# Altium project PCB_Project.PrjPcb (part 1 of 2)
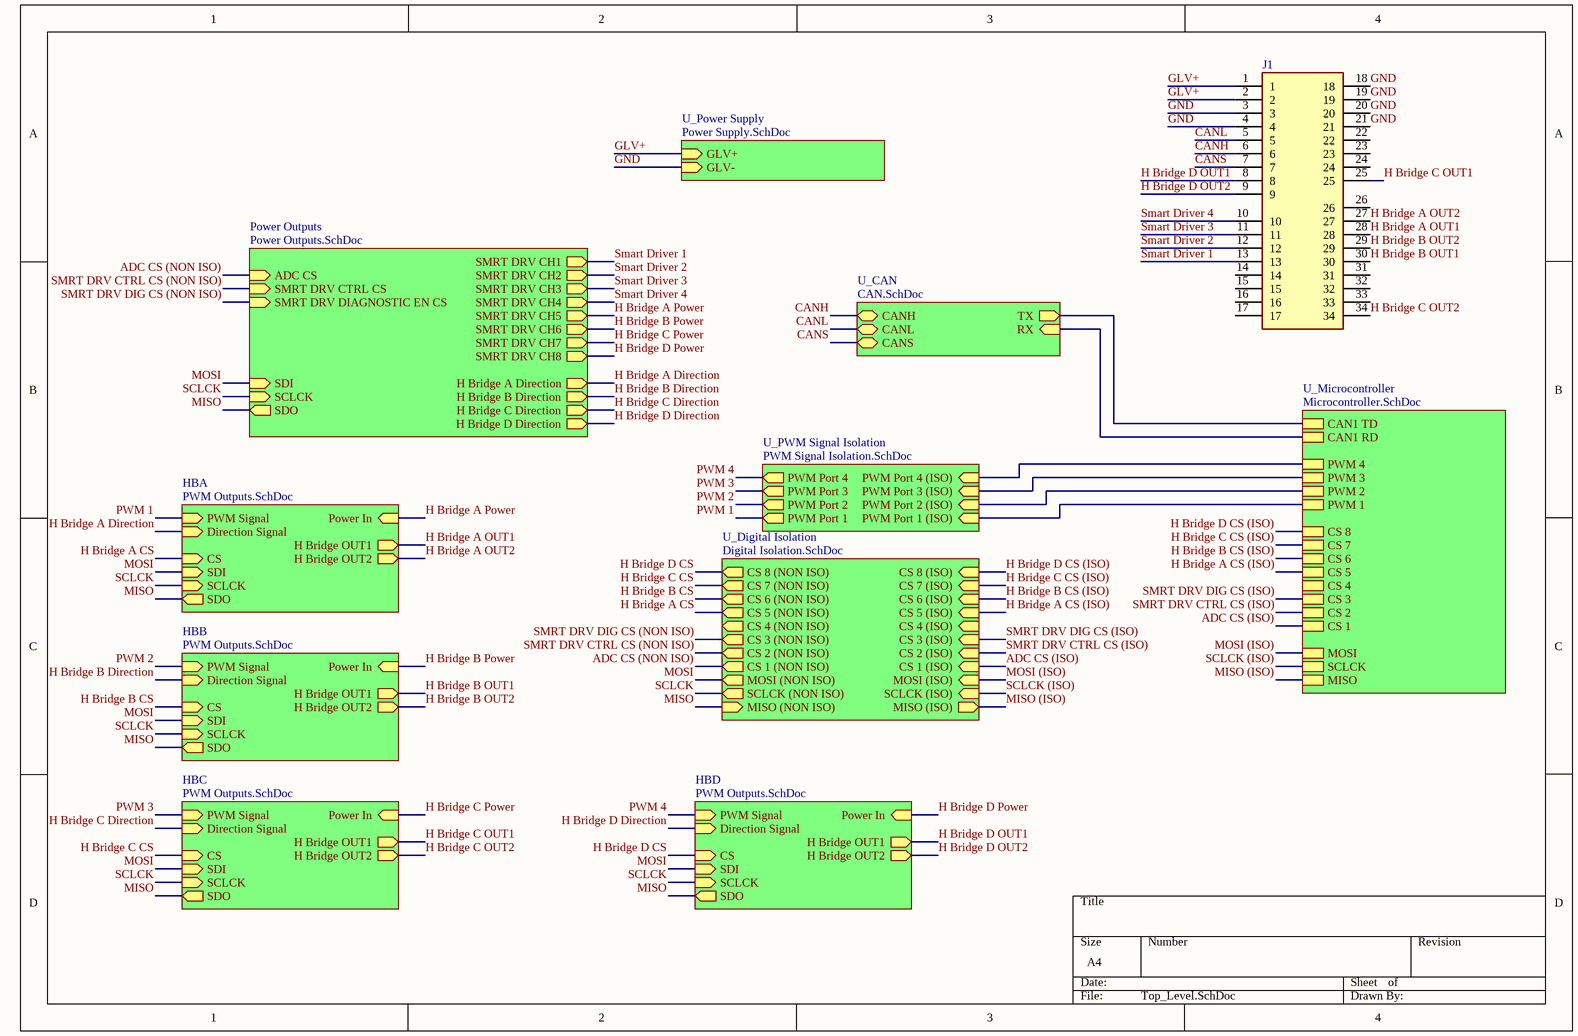
[diagram p0: Top_Level.SchDoc]
9 sheets, 193 parts. Net scope: hierarchical (ports join the sheet entries above them; power ports are global).
Board file: PCB.PcbDoc
Sheets:
  Top_Level.SchDoc
    U_Power Supply = Power Supply.SchDoc
    U_CAN = CAN.SchDoc
    Power Outputs = Power Outputs.SchDoc
      SD1 = Smart Driver Circuit.SchDoc
      SD2 = Smart Driver Circuit.SchDoc
      SD3 = Smart Driver Circuit.SchDoc
      SD4 = Smart Driver Circuit.SchDoc
    U_PWM Signal Isolation = PWM Signal Isolation.SchDoc
    U_Digital Isolation = Digital Isolation.SchDoc
    HBA = PWM Outputs.SchDoc
    HBB = PWM Outputs.SchDoc
    HBC = PWM Outputs.SchDoc
    HBD = PWM Outputs.SchDoc
    U_Microcontroller = Microcontroller.SchDoc

## Sheet Top_Level.SchDoc
size A4; SheetNumber: 1; SheetTotal: 9

### Parts
J1  (no value)  [6437288-1]

### Sub-sheets
HBA = PWM Outputs.SchDoc: PWM Signal (in), Direction Signal (in), H Bridge OUT1 (out), H Bridge OUT2 (out), SDO (out), SCLCK (in), SDI (in), CS (in), Power In (in)
HBB = PWM Outputs.SchDoc: PWM Signal (in), Direction Signal (in), H Bridge OUT1 (out), H Bridge OUT2 (out), SDO (out), SCLCK (in), SDI (in), CS (in), Power In (in)
HBC = PWM Outputs.SchDoc: PWM Signal (in), Direction Signal (in), H Bridge OUT1 (out), H Bridge OUT2 (out), SDO (out), SCLCK (in), SDI (in), CS (in), Power In (in)
HBD = PWM Outputs.SchDoc: PWM Signal (in), Direction Signal (in), H Bridge OUT1 (out), H Bridge OUT2 (out), SDO (out), SCLCK (in), SDI (in), CS (in), Power In (in)
Power Outputs = Power Outputs.SchDoc: SMRT DRV CH1 (out), SMRT DRV CH2 (out), SMRT DRV CH3 (out), SMRT DRV CH4 (out), ADC CS (in), SMRT DRV CTRL CS (in), SDO (out), SCLCK (in), SMRT DRV DIAGNOSTIC EN CS (in), SDI (in), SMRT DRV CH5 (out), SMRT DRV CH6 (out), SMRT DRV CH7 (out), SMRT DRV CH8 (out), H Bridge A Direction (out), H Bridge B Direction (out), H Bridge C Direction (out), H Bridge D Direction (out)
U_CAN = CAN.SchDoc: CANH (bidir), CANL (bidir), CANS (bidir), RX (in), TX (out)
U_Digital Isolation = Digital Isolation.SchDoc: MISO (NON ISO) (in), MOSI (NON ISO) (out), SCLCK (NON ISO) (out), MOSI (ISO) (in), SCLCK (ISO) (in), MISO (ISO) (out), CS 1 (NON ISO) (out), CS 2 (NON ISO) (out), CS 3 (NON ISO) (out), CS 4 (NON ISO) (out), CS 1 (ISO) (in), CS 2 (ISO) (in), CS 3 (ISO) (in), CS 4 (ISO) (in), CS 5 (NON ISO) (out), CS 6 (NON ISO) (out), CS 7 (NON ISO) (out), CS 8 (NON ISO) (out), CS 5 (ISO) (in), CS 6 (ISO) (in), CS 7 (ISO) (in), CS 8 (ISO) (in)
U_Microcontroller = Microcontroller.SchDoc: CAN1 RD, CAN1 TD, PWM 1, PWM 2, PWM 3, PWM 4, SCLCK, MISO, MOSI, CS 1, CS 2, CS 3, CS 4, CS 5, CS 6, CS 7, CS 8
U_Power Supply = Power Supply.SchDoc: GLV+ (in), GLV- (in)
U_PWM Signal Isolation = PWM Signal Isolation.SchDoc: PWM Port 1 (ISO) (in), PWM Port 2 (ISO) (in), PWM Port 3 (ISO) (in), PWM Port 4 (ISO) (in), PWM Port 1 (out), PWM Port 2 (out), PWM Port 3 (out), PWM Port 4 (out)

### Nets
GND: J1.3 J1.4 J1.18 J1.19 J1.20 J1.21 ; sheet U_Power Supply/GLV-  [project net 0V]
ADC CS (ISO): sheet U_Digital Isolation/CS 1 (ISO), sheet U_Microcontroller/CS 1
ADC CS (NON ISO): sheet Power Outputs/ADC CS, sheet U_Digital Isolation/CS 1 (NON ISO)
CANH: J1.6 ; sheet U_CAN/CANH  [project net CAN_H]
CANL: J1.5 ; sheet U_CAN/CANL  [project net CAN_L]
CANS: J1.7 ; sheet U_CAN/CANS
GLV+: J1.1 J1.2 ; sheet U_Power Supply/GLV+
H Bridge A CS: sheet U_Digital Isolation/CS 5 (NON ISO), sheet HBA/CS
H Bridge A CS (ISO): sheet U_Digital Isolation/CS 5 (ISO), sheet U_Microcontroller/CS 5
H Bridge A Direction: sheet Power Outputs/H Bridge A Direction, sheet HBA/Direction Signal
H Bridge A OUT1: J1.28 ; sheet HBA/H Bridge OUT1
H Bridge A OUT2: J1.27 ; sheet HBA/H Bridge OUT2
H Bridge A Power: sheet Power Outputs/SMRT DRV CH5, sheet HBA/Power In
H Bridge B CS: sheet U_Digital Isolation/CS 6 (NON ISO), sheet HBB/CS
H Bridge B CS (ISO): sheet U_Digital Isolation/CS 6 (ISO), sheet U_Microcontroller/CS 6
H Bridge B Direction: sheet Power Outputs/H Bridge B Direction, sheet HBB/Direction Signal
H Bridge B OUT1: J1.30 ; sheet HBB/H Bridge OUT1
H Bridge B OUT2: J1.29 ; sheet HBB/H Bridge OUT2
H Bridge B Power: sheet Power Outputs/SMRT DRV CH6, sheet HBB/Power In
H Bridge C CS: sheet U_Digital Isolation/CS 7 (NON ISO), sheet HBC/CS
H Bridge C CS (ISO): sheet U_Digital Isolation/CS 7 (ISO), sheet U_Microcontroller/CS 7
H Bridge C Direction: sheet Power Outputs/H Bridge C Direction, sheet HBC/Direction Signal
H Bridge C OUT1: J1.25 ; sheet HBC/H Bridge OUT1
H Bridge C OUT2: J1.34 ; sheet HBC/H Bridge OUT2
H Bridge C Power: sheet Power Outputs/SMRT DRV CH7, sheet HBC/Power In
H Bridge D CS: sheet U_Digital Isolation/CS 8 (NON ISO), sheet HBD/CS
H Bridge D CS (ISO): sheet U_Digital Isolation/CS 8 (ISO), sheet U_Microcontroller/CS 8
H Bridge D Direction: sheet Power Outputs/H Bridge D Direction, sheet HBD/Direction Signal
H Bridge D OUT1: J1.8 ; sheet HBD/H Bridge OUT1
H Bridge D OUT2: J1.9 ; sheet HBD/H Bridge OUT2
H Bridge D Power: sheet Power Outputs/SMRT DRV CH8, sheet HBD/Power In
MISO: sheet Power Outputs/SDO, sheet U_Digital Isolation/MISO (NON ISO), sheet HBA/SDO, sheet HBB/SDO, sheet HBC/SDO, sheet HBD/SDO
MISO (ISO): sheet U_Digital Isolation/MISO (ISO), sheet U_Microcontroller/MISO
MOSI: sheet Power Outputs/SDI, sheet U_Digital Isolation/MOSI (NON ISO), sheet HBA/SDI, sheet HBB/SDI, sheet HBC/SDI, sheet HBD/SDI
MOSI (ISO): sheet U_Digital Isolation/MOSI (ISO), sheet U_Microcontroller/MOSI
PWM 1: sheet U_PWM Signal Isolation/PWM Port 1, sheet HBA/PWM Signal
PWM 2: sheet U_PWM Signal Isolation/PWM Port 2, sheet HBB/PWM Signal
PWM 3: sheet U_PWM Signal Isolation/PWM Port 3, sheet HBC/PWM Signal
PWM 4: sheet U_PWM Signal Isolation/PWM Port 4, sheet HBD/PWM Signal
SCLCK: sheet Power Outputs/SCLCK, sheet U_Digital Isolation/SCLCK (NON ISO), sheet HBA/SCLCK, sheet HBB/SCLCK, sheet HBC/SCLCK, sheet HBD/SCLCK
SCLCK (ISO): sheet U_Digital Isolation/SCLCK (ISO), sheet U_Microcontroller/SCLCK
Smart Driver 1: J1.13 ; sheet Power Outputs/SMRT DRV CH1
Smart Driver 2: J1.12 ; sheet Power Outputs/SMRT DRV CH2
Smart Driver 3: J1.11 ; sheet Power Outputs/SMRT DRV CH3
Smart Driver 4: J1.10 ; sheet Power Outputs/SMRT DRV CH4
SMRT DRV CTRL CS (ISO): sheet U_Digital Isolation/CS 2 (ISO), sheet U_Microcontroller/CS 2
SMRT DRV CTRL CS (NON ISO): sheet Power Outputs/SMRT DRV CTRL CS, sheet U_Digital Isolation/CS 2 (NON ISO)
SMRT DRV DIG CS (ISO): sheet U_Digital Isolation/CS 3 (ISO), sheet U_Microcontroller/CS 3
SMRT DRV DIG CS (NON ISO): sheet Power Outputs/SMRT DRV DIAGNOSTIC EN CS, sheet U_Digital Isolation/CS 3 (NON ISO)
NetU1_11: sheet U_PWM Signal Isolation/PWM Port 4 (ISO), sheet U_Microcontroller/PWM 4
NetU1_12: sheet U_PWM Signal Isolation/PWM Port 3 (ISO), sheet U_Microcontroller/PWM 3
NetU1_13: sheet U_PWM Signal Isolation/PWM Port 2 (ISO), sheet U_Microcontroller/PWM 2
NetU1_14: sheet U_PWM Signal Isolation/PWM Port 1 (ISO), sheet U_Microcontroller/PWM 1
NetU1_45: sheet U_CAN/RX, sheet U_Microcontroller/CAN1 RD
NetU1_46: sheet U_CAN/TX, sheet U_Microcontroller/CAN1 TD

Not connected (* = marked no-connect by the designer): J1 14 15 16 17 22 23 24 26 31 32 33

### Library data of the parts
J1 = 6437288-1: 34 Position 4 Row Right Angle Receptacle Through Hole Super Seal Cap Assy; MF: TE Connectivity; Positions: 34; Pitch: 3.0 mm; Angle: 90; Contact: Gold; Price: None; MP: 6437288-1; SnapEDA_Link: https://www.snapeda.com/parts/6437288-1/TE%20Connectivity%20AMP%20Connectors/view-part/1468495/?ref=snap; Package: None; Availability: Unavailable; Value: *; Part Number: 6437288-1; Digikey Part Number: A124384-ND; Digikey Link: https://www.digikey.com.au/en/products/detail/te-connectivity-amp-connectors/6437288-1/5428601?s=N4IgTCBcDaIGwBYDMB2MAOdBaAjCAugL5A

## Sheet Power Supply.SchDoc
size A4; SheetNumber: 3; SheetTotal: 9
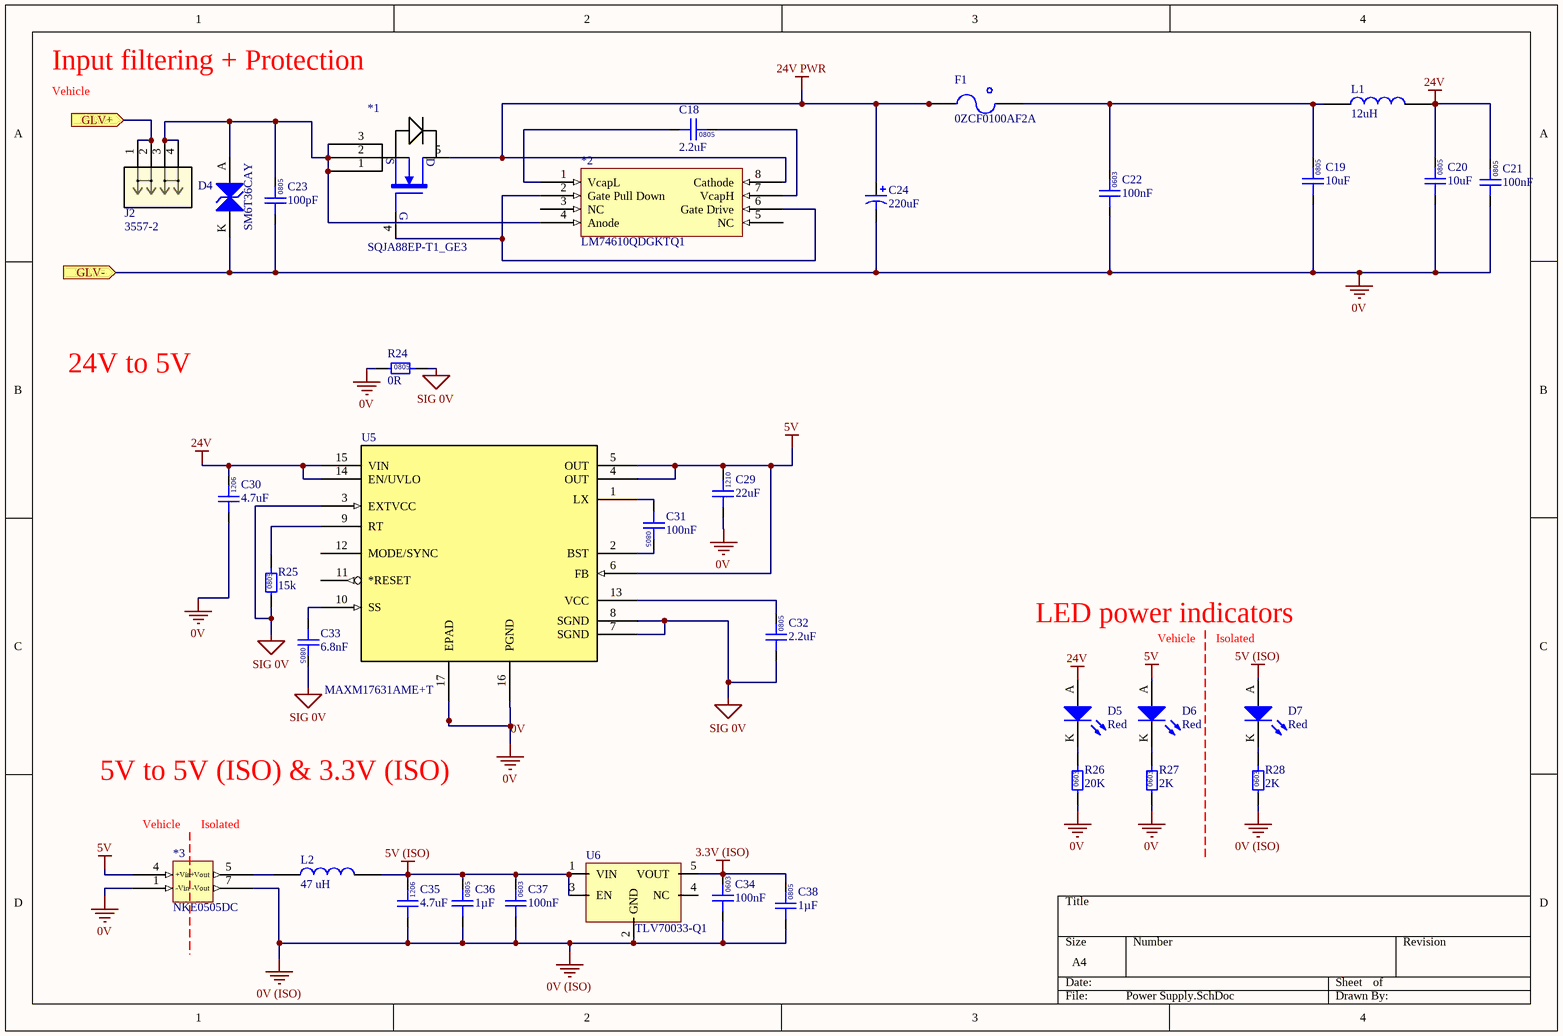
[diagram p1: Power Supply.SchDoc]

### Parts
*1  SQJA88EP-T1_GE3  [PowerPak SO-8]
*2  LM74610QDGKTQ1  [SOP65P490X110-8N]
*3  NKE0505DC  [NKE0505DC]
C18  2.2uF  [0805]
C19  10uF  [0805]
C20  10uF  [0805]
C21  100nF  [0805]
C22  100nF  [0603]
C23  100pF  [0805]
C24  220uF  [Vishay Radial 1213]
C29  22uF  [1210]
C30  4.7uF  [1206 CAP]
C31  100nF  [0805]
C32  2.2uF  [0805]
C33  6.8nF  [0805]
C34  100nF  [0603]
C35  4.7uF  [1206 CAP]
C36  1µF  [0805]
C37  100nF  [0603]
C38  1µF  [0805]
D4  SM6T36CAY  [ST SMB DIODE]
D5  Red  [0805 LED]
D6  Red  [0805 LED]
D7  Red  [0805 LED]
F1  0ZCF0100AF2A  [2920]
J2  3557-2  [35572]
L1  12uH  [1812]
L2  47 uH  [82473C]
R24  0R  [0805]
R25  15k  [0805]
R26  20K  [0603]
R27  2K  [0603]
R28  2K  [0603]
U5  MAXM17631AME+T  [MAXM17631AME+T]
U6  TLV70033-Q1  [TI SOT-23-5]

### Ports
GLV+ (in), GLV- (in)

### Nets
0V: *3.1(-Vin) C19.1 C20.1 C21.1 C22.1 C23.1 C24.1 C29.1 C30.1 D4.K R24.1 R26.1 R27.1 U5.16(PGND) U5.17(EPAD) ; port GLV-
0V (ISO): *3.7(-Vout) C34.1 C35.1 C36.1 C37.1 C38.1 R28.1 U6.2(GND)
3.3V (ISO): C34.2 C38.2 U6.5(VOUT)
5V: *3.4(+Vin) C29.2 D6.A U5.4(OUT) U5.5(OUT) U5.6(FB)
5V (ISO): C35.2 C36.2 C37.2 D7.A L2.1 U6.1(VIN) U6.3(EN)
24V: C20.2 C21.2 C30.2 D5.A L1.1 U5.14(EN/UVLO) U5.15(VIN)
24V PWR: *1.5(D) *2.8(Cathode) C24.2 F1.1
SIG 0V: C32.1 C33.2 R24.2 R25.1 U5.3(EXTVCC) U5.7(SGND) U5.8(SGND)
GLV+: J2.1 J2.2 ; port GLV+
Net*1_1: *1.1(S1) *1.2(S2) *1.3(S3) *2.4(Anode) C23.2 D4.A J2.3 J2.4
Net*1_4: *1.4(G) *2.2(Gate_Pull_Down) *2.6(Gate_Drive)
Net*2_1: *2.1(VcapL) C18.1
Net*2_7: *2.7(VcapH) C18.2
Net*3_5: *3.5(+Vout) L2.2
NetC19_2: C19.2 C22.2 F1.2 L1.2
NetC31_1: C31.1 U5.1(LX)
NetC31_2: C31.2 U5.2(BST)
NetC32_2: C32.2 U5.13(VCC)
NetC33_1: C33.1 U5.10(SS)
NetD5_K: D5.K R26.2
NetD6_K: D6.K R27.2
NetD7_K: D7.K R28.2
NetR25_2: R25.2 U5.9(RT)

Not connected (* = marked no-connect by the designer): *2 3(NC) 5(NC); U5 11(*RESET) 12(MODE/SYNC); U6 4(NC)

### Notes on the sheet
- Input filtering + Protection
- Vehicle
- 24V to 5V
- Star point grounding for signal GND
- LED power indicators
- Isolated
- (near U5) Css (soft start capacitor) tss = (Css/(5.55*10^-6)) = 1.225ms
- 5V to 5V (ISO) & 3.3V (ISO)
- (near *3) Vehicle
- (in symbol GCM21BR71H104KA37L) 0805
- (in symbol GCM21BR71H105KA03L) 0805
- (in symbol GCM188L81H104KA57D) 0603
- (in symbol GCM2165C1H101JA16D) 0805
- (in symbol GCM2195C1H682JA16D) 0805
- (in symbol GRM21BR6YA106KE43L) 0805
- (in symbol GRM21BR71E225KE11L) 0805
- (in symbol GRM31CR71H475KA12K) 1206
- (in symbol GRM32ER71E226KE15L) 1210
- (in symbol RC0603FR-072KL) 0603
- (in symbol RC0603FR-0720KL) 0603
- (in symbol RC0805FR070RL) 0805
- (in symbol RC0805FR0715KL) 0805
- (in symbol SQJA88EP-T1_GE3) S

### Library data of the parts
*1 = SQJA88EP-T1_GE3: MOSFET N-CH 40V 30A PPAK SO-8; Manufacturer: Vishay Siliconix; Rated Power: 48W; Part Number: SQJA88EP-T1_GE3; Type: N-channel; Digikey Part Number: 742-SQJA88EP-T1_GE3TR-ND
*2 = LM74610QDGKTQ1: Hot Swap Voltage Controllers Zero Iq Reverse Polarity Protection; Manufacturer: Texas Instruments; Part Number: LM74610QDGKTQ1
*3 = NKE0505DC: DC DC CONVERTER 5V 1W; Manufacturer: Murata Power Solutions Inc.; Input Voltage: 4.5 to 5.5; Output Current: 200 mA; Part Number: NKE0505DC; Output Voltage: 5V; Digikey Part Number: 811-1433-5-ND
C18 C32 = GRM21BR71E225KE11L: Manufacturer: Murata Electronics; Rated Voltage: 25V; Tolerance: ±10%; Material: MLCC; Temperature Rating: X7R; Part Number: GRM21BR71E225KE11L; Value: 2.2uF; Digikey Part Number: 490-14467-2-ND
C19 C20 = GRM21BR6YA106KE43L: Manufacturer: muRata; Rated Voltage: 50V; Tolerance: 10%; Material: MLCC; Temperature Rating: X5R; Part Number: GRM21BR6YA106KE43L; Value: 10uF; Digikey Part Number: 490-10514-6-ND
C21 C31 = GCM21BR71H104KA37L: Manufacturer: muRata; Rated Voltage: 50V; Tolerance: ±10%; Material: MLCC; Temperature Rating: X7R; Part Number: GCM21BR71H104KA37L; Value: 100nF; Digikey Part Number: 490-6064-1-ND
C22 C34 C37 = GCM188L81H104KA57D: Manufacturer: muRata; Rated Voltage: 50V; Tolerance: ±10%; Material: MLCC; Temperature Rating: X8L; Part Number: GCM188L81H104KA57D; Value: 100nF; Digikey Part Number: 490-6049-1-ND
C23 = GCM2165C1H101JA16D: Manufacturer: muRata; Rated Voltage: 50V; Tolerance: ±5%; Material: MLCC; Temperature Rating: C0G, NP0; Part Number: GCM2165C1H101JA16D; Value: 100pF; Digikey Part Number: 490-8031-1-ND
C24 = MAL214699106E3: Manufacturer: Vishay; Rated Voltage: 50V; Tolerance: 20%; Material: Aluminium Electrolytic; Temperature Rating: 125C; Part Number: MAL214699106E3; Value: 220uF; Digikey Part Number: 4440PHCT-ND
C29 = GRM32ER71E226KE15L: Manufacturer: Murata Electronics; Rated Voltage: 25V; Tolerance: ±10%; Material: MLCC; Temperature Rating: X7R; Part Number: GRM32ER71E226KE15L; Value: 22uF; Digikey Part Number: 490-5313-2-ND
C30 C35 = GRM31CR71H475KA12K: Manufacturer: Murata Electronics; Rated Voltage: 50V; Tolerance: ±10%; Material: MLCC; Temperature Rating: X7R; Part Number: GRM31CR71H475KA12K; Value: 4.7uF; Digikey Part Number: 490-GRM31CR71H475KA12KTR-ND
C33 = GCM2195C1H682JA16D: Manufacturer: muRata; Rated Voltage: 50V; Tolerance: ±5%; Material: MLCC; Temperature Rating: C0G, NP0; Part Number: GCM2195C1H682JA16D; Value: 6.8nF; Digikey Part Number: 490-4974-1-ND
C36 C38 = GCM21BR71H105KA03L: Manufacturer: muRata; Rated Voltage: 50V; Tolerance: ±10%; Material: MLCC; Temperature Rating: X7R; Part Number: GCM21BR71H105KA03L; Value: 1µF; Digikey Part Number: 490-10675-1-ND
D4 = SM6T36CAY: Manufacturer: STMicroelectronics; Forward Voltage: 30.8 V; Rated Power: 600W; Part Number: SM6T36CAY; Breakdown Voltage: 30.8 V; Digikey Part Number: 497-10804-1-ND
D5-D7 = SML-210LTT86: Red LED Indication - Discrete 1.75V 0805 (2012 Metric); Manufacturer: ROHM Semiconductor; Part Number: SML-210LTT86; Colour: Red; Digikey Part Number: 511-1286-1-ND
F1 = 0ZCF0100AF2A: PTC RESET FUSE 60V 1A 292; Manufacturer: Littelfuse Inc.; Part Number: 0ZCF0100AF2A; Digikey Part Number: 507-2070-1-ND; Digikey Link: https://www.digikey.com/product-detail/en/bel-fuse-inc/0ZCF0100AF2A/507-2070-1-ND/6210547
J2 = 3557-2: FUSE BLOCK BLADE 500V 30A PCB; Mfr_Name: Keystone Electronics; Copyright: Copyright (C) 2023 Ultra Librarian. All rights reserved.; Manufacturer_Part_Number: 3557-2; Digi-Key_Part_Number_1: 3557-2K-ND; Digi-Key_Part_Number_2: 36-3557-2-ND; Digi-Key_Part_Number_3: 36-3557-2-NDL; RefDes: RefDes; Type: DEV; Part Number: 3557-2; Manufacturer: Keystone Electronics; Digikey Part Number: 36-3557-2-ND; Digikey Link: https://www.digikey.com.au/en/products/detail/keystone-electronics/3557-2/2137305?utm_adgroup=General&utm_source=google&utm_medium=cpc&utm_campaign=PMax%20Shopping_Product_Zombie%20SKUs&utm_term=&productid=2137305&utm_id=go_cmp-17853854068_adg-_ad-__dev-c_ext-_prd-2137305_sig-Cj0KCQjw9MCnBhCYARIsAB1WQVVuVnExTR_F6-Mn3-SBphXD6FivM1Reay6dOEaGii4CYk9YgAW6_PQaAhcnEALw_wcB&gad=1&gclid=Cj0KCQjw9MCnBhCYARIsAB1WQVVuVnExTR_F6-Mn3-SBphXD6FivM1Reay6dOEaGii4CYk9YgAW6_PQaAhcnEALw_wcB
L1 = RLS-126: Manufacturer: Recom; Tolerance: 0.2; Material: Wirewound; Impedance: 230mOhm; Rated Current: 0.8 A; Part Number: RLS-126; Value: 12uH; Digikey Part Number: 945-3429-ND
L2 = 82473C: Manufacturer: Murata Power Solutions Inc.; Tolerance: 0.1; Impedance: 1.69 Ohms; Rated Current: 250mA; Material: Wirewound; Part Number: 82473C; Value: 47 uH; Digikey Part Number: 811-2477-2-ND
R24 = RC0805FR070RL: Manufacturer: YAGEO; Tolerance: 0.01; Rated Power: 0.125W; Part Number: RC0805FR070RL; Value: 0R; Material: FR-07; Digikey Part Number: 311-0.0CRCT-ND
R25 = RC0805FR0715KL: Manufacturer: YAGEO; Tolerance: 0.01; Rated Power: 0.125W; Part Number: RC0805FR0715KL; Value: 15k; Material: FR-07; Digikey Part Number: 311-15.0KCRCT-ND
R26 = RC0603FR-0720KL: Manufacturer: YAGEO; Tolerance: 0.01; Rated Power: 0.1W; Part Number: RC0603FR-0720KL; Value: 20K; Digikey Part Number: 311-20.0KHRCT-ND
R27 R28 = RC0603FR-072KL: Manufacturer: YAGEO; Tolerance: 0.01; Rated Power: 0.1W; Part Number: RC0603FR-072KL; Value: 2K; Digikey Part Number: 311-2.00KHRCT-ND
U5 = MAXM17631AME+T: DC DC CONVERTER 5V; Mfr_Name: Analog Devices Inc; Manufacturer: Analog Devices; Input Voltage: 4.5 to 36 V; Output Current: 1.0 A; Digi-Key_Part_Number_1: 175-MAXM17631AME+TTR-ND; RefDes: RefDes; Type: Type; Part Number: MAXM17631AME+T; Output Voltage: 5V; Digikey Part Number: 175-MAXM17631AME+TTR-ND
U6 = TLV70033-Q1: IC REG LINEAR 3.3V 200MA SOT23-5; Manufacturer: Texas Instruments; Input Voltage: 2 to 5.5 V; Output Current: 0.2 A; Part Number: TLV70033-Q1; Output Voltage: 3.3 V; Digikey Part Number: 296-27780-1-ND

## Sheet CAN.SchDoc
size A4; SheetNumber: 4; SheetTotal: 9
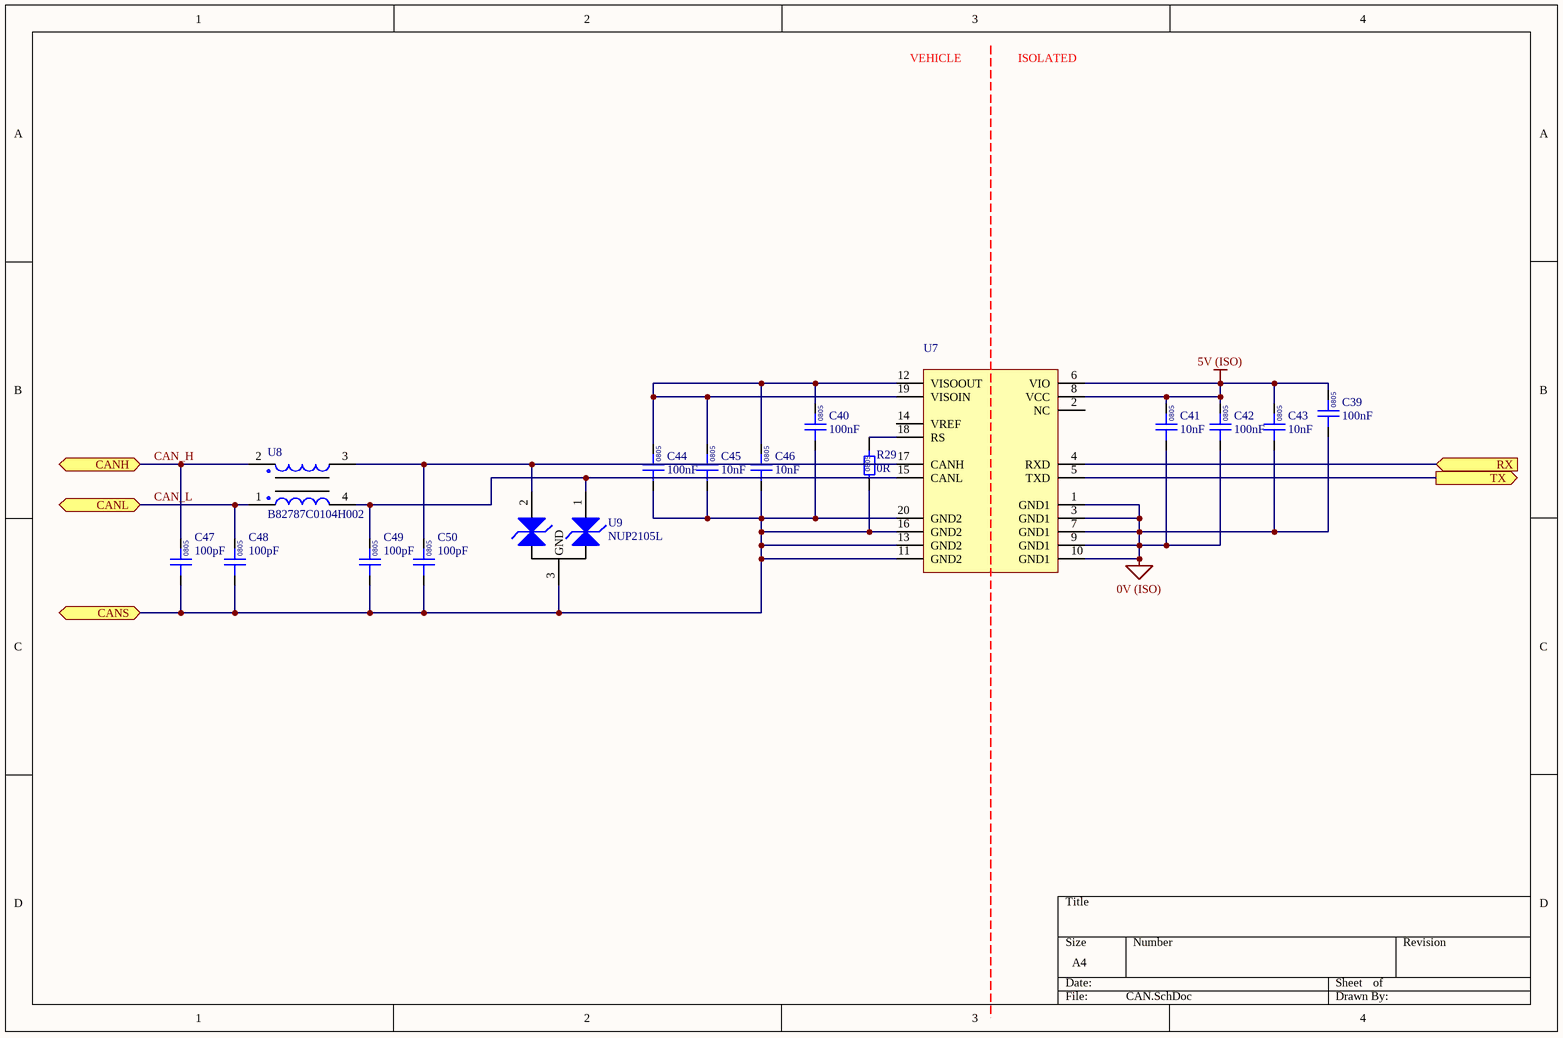
[diagram p2: CAN.SchDoc]

### Parts
C39  100nF  [0805]
C40  100nF  [0805]
C41  10nF  [0805]
C42  100nF  [0805]
C43  10nF  [0805]
C44  100nF  [0805]
C45  10nF  [0805]
C46  10nF  [0805]
C47  100pF  [0805]
C48  100pF  [0805]
C49  100pF  [0805]
C50  100pF  [0805]
R29  0R  [0805]
U7  (no value)  [AD SOIC-W 20]
U8  B82787C0104H002  [TDK 4-PC Pad]
U9  NUP2105L  [ON SOT-23]

### Ports
CANH (bidir), CANL (bidir), CANS (bidir), RX (in), TX (out)

### Nets
0V (ISO): C39.1 C41.1 C42.1 C43.1 U7.1(GND1) U7.3(GND1) U7.7(GND1) U7.9(GND1) U7.10(GND1)
5V (ISO): C39.2 C41.2 C42.2 C43.2 U7.6(VIO) U7.8(VCC)
CAN_H: C47.2 U8.2 ; port CANH
CAN_L: C48.2 U8.1 ; port CANL
CANS: C40.1 C44.1 C45.1 C46.1 C47.1 C48.1 C49.1 C50.1 R29.1 U7.11(GND2) U7.13(GND2) U7.16(GND2) U7.20(GND2) U9.3(GND) ; port CANS
NetC40_2: C40.2 C44.2 C45.2 C46.2 U7.12(VISOOUT) U7.19(VISOIN)
NetC49_2: C49.2 U7.15(CANL) U8.4 U9.1(CAN_H)
NetC50_2: C50.2 U7.17(CANH) U8.3 U9.2(CAN_L)
NetR29_2: R29.2 U7.18(RS)
NetU1_45: U7.4(RXD) ; port RX
NetU1_46: U7.5(TXD) ; port TX

Not connected (* = marked no-connect by the designer): U7 2(NC) 14(VREF)

### Notes on the sheet
- VEHICLE
- ISOLATED
- (in symbol GCM21BR71H104KA37L) 0805
- (in symbol GCM2165C1H101JA16D) 0805
- (in symbol GCM2195C1H103JA16D) 0805
- (in symbol RC0805FR070RL) 0805

### Library data of the parts
C39 C40 C42 C44 = GCM21BR71H104KA37L: Manufacturer: muRata; Tolerance: ±10%; Material: MLCC; Rated Voltage: 50V; Temperature Rating: X7R; Part Number: GCM21BR71H104KA37L; Value: 100nF; Digikey Part Number: 490-6064-1-ND
C41 C43 C45 C46 = GCM2195C1H103JA16D: Manufacturer: muRata; Tolerance: ±5%; Material: MLCC; Rated Voltage: 50V; Temperature Rating: C0G, NP0; Part Number: GCM2195C1H103JA16D; Value: 10nF; Digikey Part Number: 490-4783-1-ND
C47-C50 = GCM2165C1H101JA16D: Manufacturer: muRata; Tolerance: ±5%; Material: MLCC; Rated Voltage: 50V; Temperature Rating: C0G, NP0; Part Number: GCM2165C1H101JA16D; Value: 100pF; Digikey Part Number: 490-8031-1-ND
R29 = RC0805FR070RL: as R24 on sheet Power Supply; Part Number: RC0805FR070RL; Value: 0R; Material: FR-07; Digikey Part Number: 311-0.0CRCT-ND
U7 = ADM3053: Isolated CAN Transceiver; Manufacturer: Analogue Devices; Part Number: ADM3053; Digikey Part Number: ADM3053BRWZ-ND; Digikey Link: https://www.digikey.com/product-detail/en/analog-devices-inc/ADM3053BRWZ/ADM3053BRWZ-ND/2709332
U8 = B82787C0104H002: Manufacturer: EPCOS (TDK); Value: 100µH @ 100kHz; Impedance: 5.8 kOhms @ 10MHz; Rated Current: 150mA; Part Number: B82787C0104H002; Material: Wirewound; Digikey Part Number: 495-4598-1-ND
U9 = NUP2105L: Dual Line CAN Bus Protector; Manufacturer: ON Semiconductor; Part Number: NUP2105L; Digikey Part Number: NUP2105LT1GOSCT-ND; Digikey Link: https://www.digikey.com/product-detail/en/on-semiconductor/NUP2105LT1G/NUP2105LT1GOSCT-ND/1485001

## Sheet Power Outputs.SchDoc
size A4; SheetNumber: 5; SheetTotal: 9
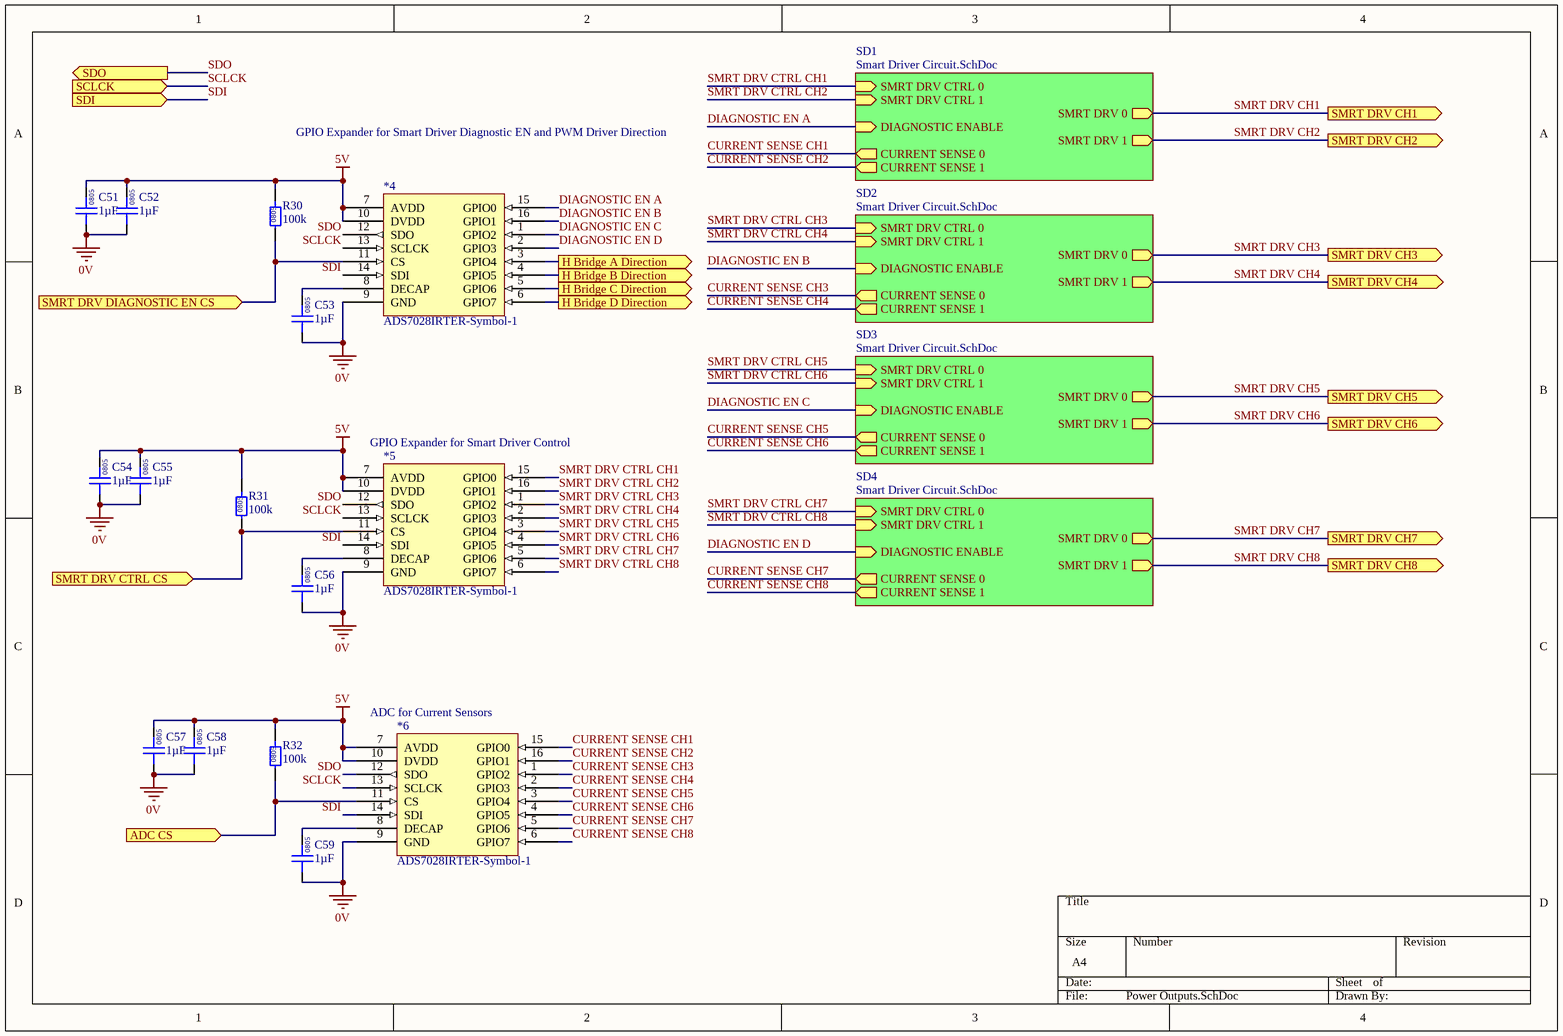
[diagram p3: Power Outputs.SchDoc]

### Parts
*4  ADS7028IRTER-Symbol-1  [QFN50P300X300X80_HS-17N]
*5  ADS7028IRTER-Symbol-1  [QFN50P300X300X80_HS-17N]
*6  ADS7028IRTER-Symbol-1  [QFN50P300X300X80_HS-17N]
C51  1µF  [0805]
C52  1µF  [0805]
C53  1µF  [0805]
C54  1µF  [0805]
C55  1µF  [0805]
C56  1µF  [0805]
C57  1µF  [0805]
C58  1µF  [0805]
C59  1µF  [0805]
R30  100k  [0805]
R31  100k  [0805]
R32  100k  [0805]

### Sub-sheets
SD1 = Smart Driver Circuit.SchDoc: SMRT DRV CTRL 0 (in), SMRT DRV CTRL 1 (in), CURRENT SENSE 0 (out), CURRENT SENSE 1 (out), DIAGNOSTIC ENABLE (in), SMRT DRV 0 (out), SMRT DRV 1 (out)
SD2 = Smart Driver Circuit.SchDoc: SMRT DRV CTRL 0 (in), SMRT DRV CTRL 1 (in), CURRENT SENSE 0 (out), CURRENT SENSE 1 (out), DIAGNOSTIC ENABLE (in), SMRT DRV 0 (out), SMRT DRV 1 (out)
SD3 = Smart Driver Circuit.SchDoc: SMRT DRV CTRL 0 (in), SMRT DRV CTRL 1 (in), CURRENT SENSE 0 (out), CURRENT SENSE 1 (out), DIAGNOSTIC ENABLE (in), SMRT DRV 0 (out), SMRT DRV 1 (out)
SD4 = Smart Driver Circuit.SchDoc: SMRT DRV CTRL 0 (in), SMRT DRV CTRL 1 (in), CURRENT SENSE 0 (out), CURRENT SENSE 1 (out), DIAGNOSTIC ENABLE (in), SMRT DRV 0 (out), SMRT DRV 1 (out)

### Ports
ADC CS (in), H Bridge A Direction (out), H Bridge B Direction (out), H Bridge C Direction (out), H Bridge D Direction (out), SCLCK (in), SDI (in), SDO (out), SMRT DRV CH1 (out), SMRT DRV CH2 (out), SMRT DRV CH3 (out), SMRT DRV CH4 (out), SMRT DRV CH5 (out), SMRT DRV CH6 (out), SMRT DRV CH7 (out), SMRT DRV CH8 (out), SMRT DRV CTRL CS (in), SMRT DRV DIAGNOSTIC EN CS (in)

### Nets
0V: *4.9(GND) *5.9(GND) *6.9(GND) C51.1 C52.1 C53.1 C54.1 C55.1 C56.1 C57.1 C58.1 C59.1
5V: *4.7(AVDD) *4.10(DVDD) *5.7(AVDD) *5.10(DVDD) *6.7(AVDD) *6.10(DVDD) C51.2 C52.2 C54.2 C55.2 C57.2 C58.2 R30.2 R31.2 R32.2
ADC CS (NON ISO): *6.11(CS) R32.1 ; port ADC CS
CURRENT SENSE CH1: *6.15(GPIO0) ; sheet SD1/CURRENT SENSE 0
CURRENT SENSE CH2: *6.16(GPIO1) ; sheet SD1/CURRENT SENSE 1
CURRENT SENSE CH3: *6.1(GPIO2) ; sheet SD2/CURRENT SENSE 0
CURRENT SENSE CH4: *6.2(GPIO3) ; sheet SD2/CURRENT SENSE 1
CURRENT SENSE CH5: *6.3(GPIO4) ; sheet SD3/CURRENT SENSE 0
CURRENT SENSE CH6: *6.4(GPIO5) ; sheet SD3/CURRENT SENSE 1
CURRENT SENSE CH7: *6.5(GPIO6) ; sheet SD4/CURRENT SENSE 0
CURRENT SENSE CH8: *6.6(GPIO7) ; sheet SD4/CURRENT SENSE 1
DIAGNOSTIC EN A: *4.15(GPIO0) ; sheet SD1/DIAGNOSTIC ENABLE
DIAGNOSTIC EN B: *4.16(GPIO1) ; sheet SD2/DIAGNOSTIC ENABLE
DIAGNOSTIC EN C: *4.1(GPIO2) ; sheet SD3/DIAGNOSTIC ENABLE
DIAGNOSTIC EN D: *4.2(GPIO3) ; sheet SD4/DIAGNOSTIC ENABLE
H Bridge A Direction: *4.3(GPIO4) ; port H Bridge A Direction
H Bridge B Direction: *4.4(GPIO5) ; port H Bridge B Direction
H Bridge C Direction: *4.5(GPIO6) ; port H Bridge C Direction
H Bridge D Direction: *4.6(GPIO7) ; port H Bridge D Direction
SCLCK: *4.13(SCLCK) *5.13(SCLCK) *6.13(SCLCK) ; port SCLCK
SDI: *4.14(SDI) *5.14(SDI) *6.14(SDI) ; port SDI  [project net MOSI]
SDO: *4.12(SDO) *5.12(SDO) *6.12(SDO) ; port SDO  [project net MISO]
SMRT DRV CH1: port SMRT DRV CH1, sheet SD1/SMRT DRV 0  [project net Smart Driver 1]
SMRT DRV CH2: port SMRT DRV CH2, sheet SD1/SMRT DRV 1  [project net Smart Driver 2]
SMRT DRV CH3: port SMRT DRV CH3, sheet SD2/SMRT DRV 0  [project net Smart Driver 3]
SMRT DRV CH4: port SMRT DRV CH4, sheet SD2/SMRT DRV 1  [project net Smart Driver 4]
SMRT DRV CH5: port SMRT DRV CH5, sheet SD3/SMRT DRV 0  [project net H Bridge A Power]
SMRT DRV CH6: port SMRT DRV CH6, sheet SD3/SMRT DRV 1  [project net H Bridge B Power]
SMRT DRV CH7: port SMRT DRV CH7, sheet SD4/SMRT DRV 0  [project net H Bridge C Power]
SMRT DRV CH8: port SMRT DRV CH8, sheet SD4/SMRT DRV 1  [project net H Bridge D Power]
SMRT DRV CTRL CH1: *5.15(GPIO0) ; sheet SD1/SMRT DRV CTRL 0
SMRT DRV CTRL CH2: *5.16(GPIO1) ; sheet SD1/SMRT DRV CTRL 1
SMRT DRV CTRL CH3: *5.1(GPIO2) ; sheet SD2/SMRT DRV CTRL 0
SMRT DRV CTRL CH4: *5.2(GPIO3) ; sheet SD2/SMRT DRV CTRL 1
SMRT DRV CTRL CH5: *5.3(GPIO4) ; sheet SD3/SMRT DRV CTRL 0
SMRT DRV CTRL CH6: *5.4(GPIO5) ; sheet SD3/SMRT DRV CTRL 1
SMRT DRV CTRL CH7: *5.5(GPIO6) ; sheet SD4/SMRT DRV CTRL 0
SMRT DRV CTRL CH8: *5.6(GPIO7) ; sheet SD4/SMRT DRV CTRL 1
SMRT DRV CTRL CS (NON ISO): *5.11(CS) R31.1 ; port SMRT DRV CTRL CS
SMRT DRV DIG CS (NON ISO): *4.11(CS) R30.1 ; port SMRT DRV DIAGNOSTIC EN CS
Net*4_8: *4.8(DECAP) C53.2
Net*5_8: *5.8(DECAP) C56.2
Net*6_8: *6.8(DECAP) C59.2

### Notes on the sheet
- GPIO Expander for Smart Driver Diagnostic EN and PWM Driver Direction
- (near *5) GPIO Expander for Smart Driver Control
- (near *6) ADC for Current Sensors
- (in symbol GCM21BR71H105KA03L) 0805
- (in symbol RC0805FR07100KL) 0805

### Library data of the parts
*4-*6 = ADS7028IRTER: IC ADC 12BIT SAR 16WQFN; Manufacturer: Texas Instruments; Part Number: ADS7028IRTER; Digikey Part Number: ADS7028IRTER; Digikey Link: https://www.digikey.com.au/en/products/detail/texas-instruments/ADS7028IRTER/12696020?s=N4IgTCBcDaIIIBEDKB2ADGAHASQEoBUBRXEAXQF8g
C51-C59 = GCM21BR71H105KA03L: as C36 on sheet Power Supply; Part Number: GCM21BR71H105KA03L; Value: 1µF; Digikey Part Number: 490-10675-1-ND
R30-R32 = RC0805FR07100KL: Manufacturer: YAGEO; Tolerance: 0.01; Rated Power: 0.125W; Part Number: RC0805FR07100KL; Value: 100k; Material: FR-07; Digikey Part Number: 311-100KCRCT-ND

## Sheet Smart Driver Circuit.SchDoc
size A4; SheetNumber: 6; SheetTotal: 9
Used 4 times, as channels Power Outputs/SD1, Power Outputs/SD2, Power Outputs/SD3, Power Outputs/SD4. Parts and nets are listed once, with the designators drawn on the sheet.
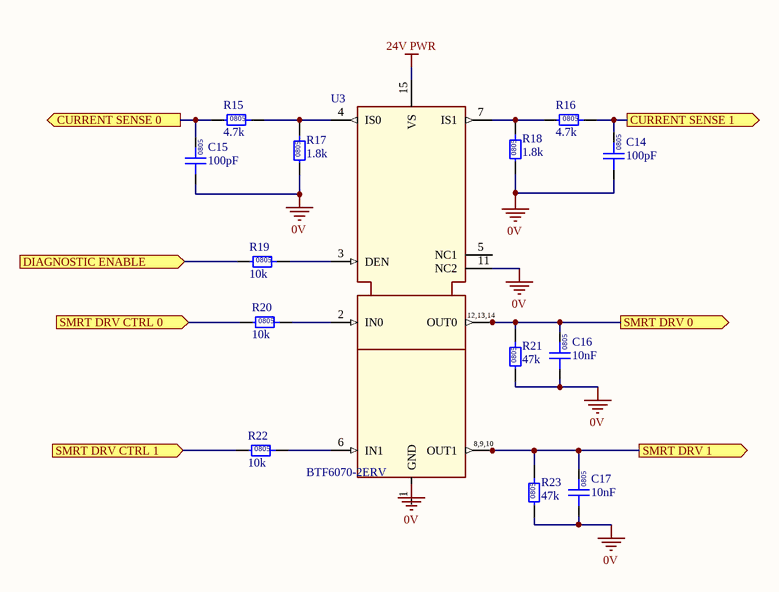
[diagram p4: Smart Driver Circuit.SchDoc]

### Parts
C14  100pF  [0805]
C15  100pF  [0805]
C16  10nF  [0805]
C17  10nF  [0805]
R15  4.7k  [0805]
R16  4.7k  [0805]
R17  1.8k  [0805]
R18  1.8k  [0805]
R19  10k  [0805]
R20  10k  [0805]
R21  47k  [0805]
R22  10k  [0805]
R23  47k  [0805]
U3  BTF6070-2ERV  [SOIC127P600X115-15N-V1]

### Ports
CURRENT SENSE 0 (out), CURRENT SENSE 1 (out), DIAGNOSTIC ENABLE (in), SMRT DRV 0 (out), SMRT DRV 1 (out), SMRT DRV CTRL 0 (in), SMRT DRV CTRL 1 (in)

### Nets
0V: C14.1 C15.1 C16.1 C17.1 R17.1 R18.1 R21.1 R23.1 U3.11(NC2)
24V PWR: U3.15(VS)
CURRENT SENSE 0: C15.2 R15.1 ; port CURRENT SENSE 0
CURRENT SENSE 1: C14.2 R16.2 ; port CURRENT SENSE 1
DIAGNOSTIC ENABLE: R19.1 ; port DIAGNOSTIC ENABLE
SMRT DRV 0: C16.2 R21.2 U3.12(OUT0) U3.13(OUT0) U3.14(OUT0) ; port SMRT DRV 0
SMRT DRV 1: C17.2 R23.2 U3.8(OUT1) U3.9(OUT1) U3.10(OUT1) ; port SMRT DRV 1
SMRT DRV CTRL 0: R20.1 ; port SMRT DRV CTRL 0
SMRT DRV CTRL 1: R22.1 ; port SMRT DRV CTRL 1
NetR15_2: R15.2 R17.2 U3.4(IS0)
NetR16_1: R16.1 R18.2 U3.7(IS1)
NetR19_2: R19.2 U3.3(DEN)
NetR20_2: R20.2 U3.2(IN0)
NetR22_2: R22.2 U3.6(IN1)

Not connected (* = marked no-connect by the designer): U3 1(GND) 5(NC1)

### Channels
Power Outputs/SD1: designators end in _SD1; ports CURRENT SENSE 0=CURRENT SENSE CH1 CURRENT SENSE 1=CURRENT SENSE CH2 DIAGNOSTIC ENABLE=DIAGNOSTIC EN A SMRT DRV 0=Smart Driver 1 SMRT DRV 1=Smart Driver 2 SMRT DRV CTRL 0=SMRT DRV CTRL CH1 SMRT DRV CTRL 1=SMRT DRV CTRL CH2
Power Outputs/SD2: designators end in _SD2; ports CURRENT SENSE 0=CURRENT SENSE CH3 CURRENT SENSE 1=CURRENT SENSE CH4 DIAGNOSTIC ENABLE=DIAGNOSTIC EN B SMRT DRV 0=Smart Driver 3 SMRT DRV 1=Smart Driver 4 SMRT DRV CTRL 0=SMRT DRV CTRL CH3 SMRT DRV CTRL 1=SMRT DRV CTRL CH4
Power Outputs/SD3: designators end in _SD3; ports CURRENT SENSE 0=CURRENT SENSE CH5 CURRENT SENSE 1=CURRENT SENSE CH6 DIAGNOSTIC ENABLE=DIAGNOSTIC EN C SMRT DRV 0=H Bridge A Power SMRT DRV 1=H Bridge B Power SMRT DRV CTRL 0=SMRT DRV CTRL CH5 SMRT DRV CTRL 1=SMRT DRV CTRL CH6
Power Outputs/SD4: designators end in _SD4; ports CURRENT SENSE 0=CURRENT SENSE CH7 CURRENT SENSE 1=CURRENT SENSE CH8 DIAGNOSTIC ENABLE=DIAGNOSTIC EN D SMRT DRV 0=H Bridge C Power SMRT DRV 1=H Bridge D Power SMRT DRV CTRL 0=SMRT DRV CTRL CH7 SMRT DRV CTRL 1=SMRT DRV CTRL CH8

### Notes on the sheet
- Labels drawn without touching a wire or pin: 0V
- (in symbol BTF60702ERVXUMA1) 12,13,14; 8,9,10
- (in symbol GCM2165C1H101JA16D) 0805
- (in symbol GCM2195C1H103JA16D) 0805
- (in symbol RC0805FR071K8L) 0805
- (in symbol RC0805FR074K7L) 0805
- (in symbol RC0805FR0710KL) 0805
- (in symbol RC0805FR0747KL) 0805

### Library data of the parts
C14 C15 = GCM2165C1H101JA16D: as C23 on sheet Power Supply; Part Number: GCM2165C1H101JA16D; Value: 100pF; Digikey Part Number: 490-8031-1-ND
C16 C17 = GCM2195C1H103JA16D: Manufacturer: muRata; Rated Voltage: 50V; Tolerance: ±5%; Material: MLCC; Temperature Rating: C0G, NP0; Part Number: GCM2195C1H103JA16D; Value: 10nF; Digikey Part Number: 490-4783-1-ND
R15 R16 = RC0805FR074K7L: Manufacturer: YAGEO; Tolerance: 0.01; Rated Power: 0.125W; Part Number: RC0805FR074K7L; Value: 4.7k; Material: FR-07; Digikey Part Number: 311-4.70KCRCT-ND
R17 R18 = RC0805FR071K8L: Manufacturer: YAGEO; Tolerance: 0.01; Rated Power: 0.125W; Part Number: RC0805FR071K8L; Value: 1.8k; Material: FR-07; Digikey Part Number: 311-1.80KCRCT-ND
R19 R20 R22 = RC0805FR0710KL: Manufacturer: YAGEO; Tolerance: 0.01; Rated Power: 0.125W; Part Number: RC0805FR0710KL; Value: 10k; Material: FR-07; Digikey Part Number: 311-10.0KCRCT-ND
R21 R23 = RC0805FR0747KL: Manufacturer: YAGEO; Tolerance: 0.01; Rated Power: 0.125W; Part Number: RC0805FR0747KL; Value: 47k; Material: FR-07; Digikey Part Number: 311-47.0KCRCT-ND
U3 = BTF60702ERVXUMA1: Smart High-Side Power Switch, Dual Channel; Manufacturer: Infineon Technologies; PackageReference: PG-TDSO-14-21; ManufacturerPartNumber: BTF6070-2ERV; Part Number: BTF60702ERVXUMA1; Digikey Part Number: 448-BTF60702ERVXUMA1TR-ND; Digikey Link: https://www.digikey.com.au/en/products/detail/infineon-technologies/BTF60702ERVXUMA1/10379692

## Sheet PWM Signal Isolation.SchDoc
size A3; SheetNumber: 9; SheetTotal: 9
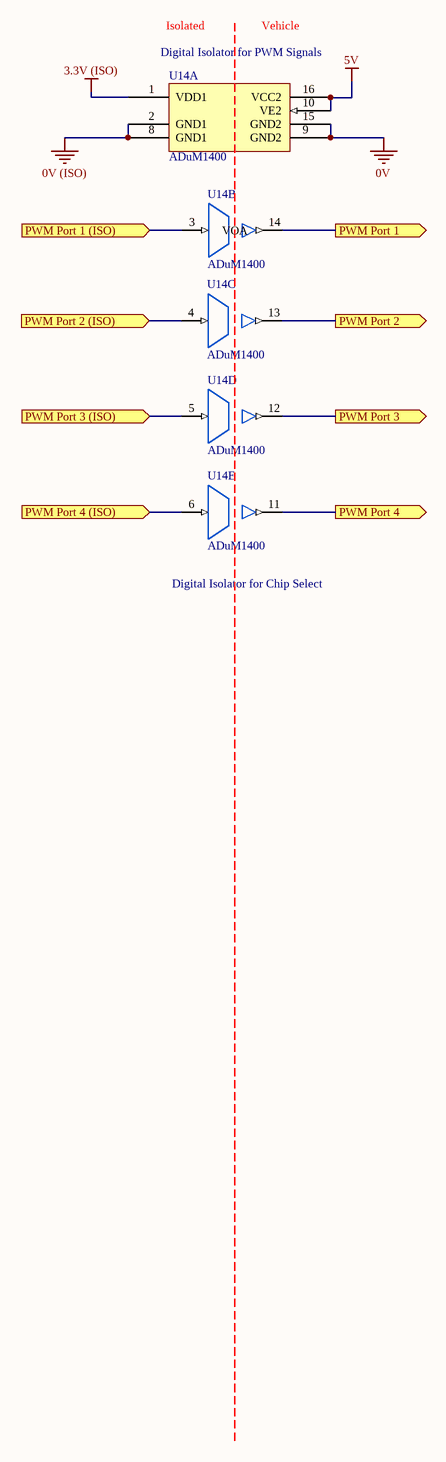
[diagram p5: PWM Signal Isolation.SchDoc]

### Parts
U14  ADuM1400  [AD 16-SOIC]  (parts A,B,C,D,E of 5)

### Ports
PWM Port 1 (ISO) (in), PWM Port 1 (out), PWM Port 2 (ISO) (in), PWM Port 2 (out), PWM Port 3 (ISO) (in), PWM Port 3 (out), PWM Port 4 (ISO) (in), PWM Port 4 (out)

### Nets
0V: U14.9(GND2) U14.15(GND2)
0V (ISO): U14.2(GND1) U14.8(GND1)
3.3V (ISO): U14.1(VDD1)
5V: U14.10(VE2) U14.16(VCC2)
PWM 1: U14.14(VOA) ; port PWM Port 1
PWM 2: U14.13(VOB) ; port PWM Port 2
PWM 3: U14.12(VOC) ; port PWM Port 3
PWM 4: U14.11(VOD) ; port PWM Port 4
NetU1_11: U14.6(VID) ; port PWM Port 4 (ISO)
NetU1_12: U14.5(VIC) ; port PWM Port 3 (ISO)
NetU1_13: U14.4(VIB) ; port PWM Port 2 (ISO)
NetU1_14: U14.3(VIA) ; port PWM Port 1 (ISO)

### Notes on the sheet
- (near U14) Digital Isolator for PWM Signals
- Isolated
- Vehicle
- Digital Isolator for Chip Select

### Library data of the parts
U14 = ADuM1400: General Purpose Digital Isolator 2500Vrms 4 Channel 1Mbps 25kV/µs CMTI 16-SOIC (0.295", 7.50mm Width); Manufacturer: Analog Devices; Part Number: ADuM1400; Digikey Part Number: ADUM1400WSRWZ-ND; Digikey Link: https://www.digikey.com/product-detail/en/analog-devices-inc/ADUM1400WSRWZ/ADUM1400WSRWZ-ND/1873713

## Sheet Digital Isolation.SchDoc
size A3; SheetNumber: 7; SheetTotal: 9
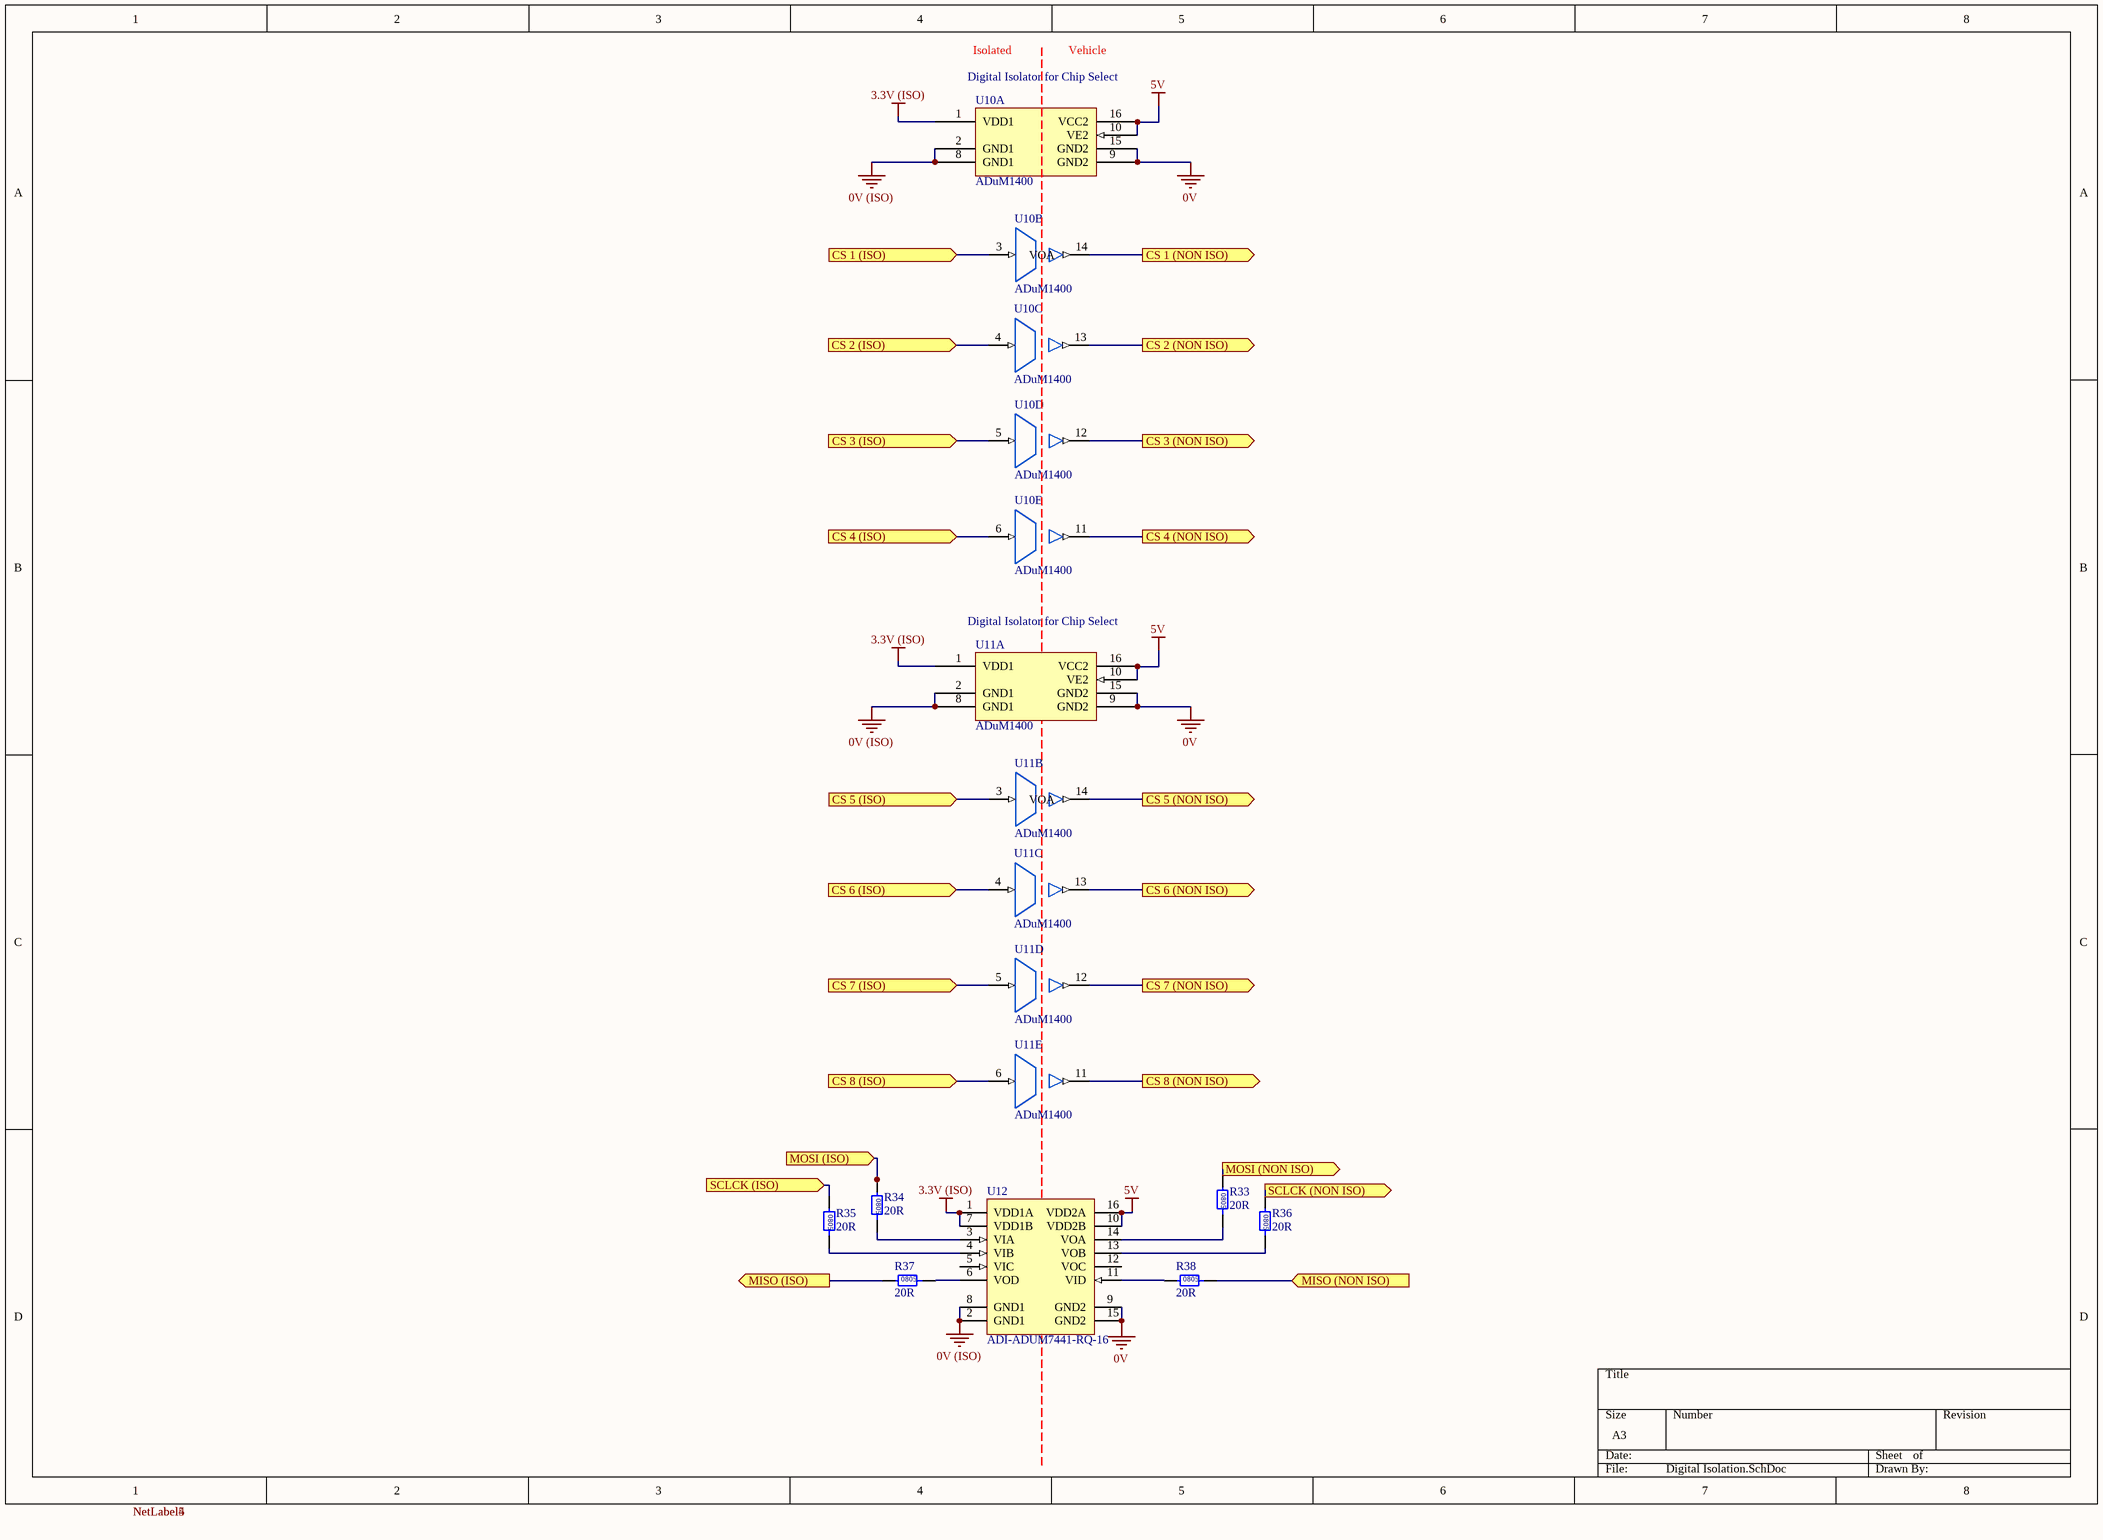
[diagram p6: Digital Isolation.SchDoc]

### Parts
R33  20R  [0805]
R34  20R  [0805]
R35  20R  [0805]
R36  20R  [0805]
R37  20R  [0805]
R38  20R  [0805]
U10  ADuM1400  [AD 16-SOIC]  (parts A,B,C,D,E of 5)
U11  ADuM1400  [AD 16-SOIC]  (parts A,B,C,D,E of 5)
U12  ADI-ADUM7441-RQ-16  [ADI-RQ-16_M]

### Ports
CS 1 (ISO) (in), CS 1 (NON ISO) (out), CS 2 (ISO) (in), CS 2 (NON ISO) (out), CS 3 (ISO) (in), CS 3 (NON ISO) (out), CS 4 (ISO) (in), CS 4 (NON ISO) (out), CS 5 (ISO) (in), CS 5 (NON ISO) (out), CS 6 (ISO) (in), CS 6 (NON ISO) (out), CS 7 (ISO) (in), CS 7 (NON ISO) (out), CS 8 (ISO) (in), CS 8 (NON ISO) (out), MISO (ISO) (out), MISO (NON ISO) (in), MOSI (ISO) (in), MOSI (NON ISO) (out), SCLCK (ISO) (in), SCLCK (NON ISO) (out)

### Nets
0V: U10.9(GND2) U10.15(GND2) U11.9(GND2) U11.15(GND2) U12.9(GND2) U12.15(GND2)
0V (ISO): U10.2(GND1) U10.8(GND1) U11.2(GND1) U11.8(GND1) U12.2(GND1) U12.8(GND1)
3.3V (ISO): U10.1(VDD1) U11.1(VDD1) U12.1(VDD1A) U12.7(VDD1B)
5V: U10.10(VE2) U10.16(VCC2) U11.10(VE2) U11.16(VCC2) U12.10(VDD2B) U12.16(VDD2A)
ADC CS (ISO): U10.3(VIA) ; port CS 1 (ISO)
ADC CS (NON ISO): U10.14(VOA) ; port CS 1 (NON ISO)
H Bridge A CS: U11.14(VOA) ; port CS 5 (NON ISO)
H Bridge A CS (ISO): U11.3(VIA) ; port CS 5 (ISO)
H Bridge B CS: U11.13(VOB) ; port CS 6 (NON ISO)
H Bridge B CS (ISO): U11.4(VIB) ; port CS 6 (ISO)
H Bridge C CS: U11.12(VOC) ; port CS 7 (NON ISO)
H Bridge C CS (ISO): U11.5(VIC) ; port CS 7 (ISO)
H Bridge D CS: U11.11(VOD) ; port CS 8 (NON ISO)
H Bridge D CS (ISO): U11.6(VID) ; port CS 8 (ISO)
MISO: R38.2 ; port MISO (NON ISO)
MISO (ISO): R37.1 ; port MISO (ISO)
MOSI: R33.1 ; port MOSI (NON ISO)
MOSI (ISO): R34.1 ; port MOSI (ISO)
SCLCK: R36.1 ; port SCLCK (NON ISO)
SCLCK (ISO): R35.1 ; port SCLCK (ISO)
SMRT DRV CTRL CS (ISO): U10.4(VIB) ; port CS 2 (ISO)
SMRT DRV CTRL CS (NON ISO): U10.13(VOB) ; port CS 2 (NON ISO)
SMRT DRV DIG CS (ISO): U10.5(VIC) ; port CS 3 (ISO)
SMRT DRV DIG CS (NON ISO): U10.12(VOC) ; port CS 3 (NON ISO)
NetR33_2: R33.2 U12.14(VOA)
NetR34_2: R34.2 U12.3(VIA)
NetR35_2: R35.2 U12.4(VIB)
NetR36_2: R36.2 U12.13(VOB)
NetR37_2: R37.2 U12.6(VOD)
NetR38_1: R38.1 U12.11(VID)
NetU10_6: U10.6(VID) ; port CS 4 (ISO)
NetU10_11: U10.11(VOD) ; port CS 4 (NON ISO)

Not connected (* = marked no-connect by the designer): U12 5(VIC) 12(VOC)

### Notes on the sheet
- (near U10) Digital Isolator for Chip Select
- Isolated
- Vehicle
- (near U11) Digital Isolator for Chip Select
- (in symbol RC0805FR0720RL) 0805

### Library data of the parts
R33-R38 = RC0805FR0720RL: Manufacturer: YAGEO; Tolerance: 0.01; Rated Power: 0.125W; Part Number: RC0805FR0720RL; Value: 20R; Material: FR-07; Digikey Part Number: 311-20.0CRCT-ND
U10 U11 = ADuM1400: as U14 on sheet PWM Signal Isolation; Part Number: ADuM1400; Digikey Part Number: ADUM1400WSRWZ-ND; Digikey Link: https://www.digikey.com/product-detail/en/analog-devices-inc/ADUM1400WSRWZ/ADUM1400WSRWZ-ND/1873713
U12 = ADUM7441ARQZ-RL7: DGTL ISO 1000VRMS 4CH GP 16QSOP; Manufacturer: Analog Devices; Part Number: ADUM7441ARQZ-RL7; Digikey Part Number: ADUM7441ARQZ-RL7TR-ND; Digikey Link: https://www.digikey.com.au/en/products/detail/analog-devices-inc/ADUM7441ARQZ-RL7/2261109?s=N4IgTCBcDaIIIBECqBZA7AFgwRjgJQEUAtAWjwBk0QBdAXyA

## Sheet PWM Outputs.SchDoc
size A4; SheetNumber: 8; SheetTotal: 9
Used 4 times, as channels HBA, HBB, HBC, HBD. Parts and nets are listed once, with the designators drawn on the sheet.
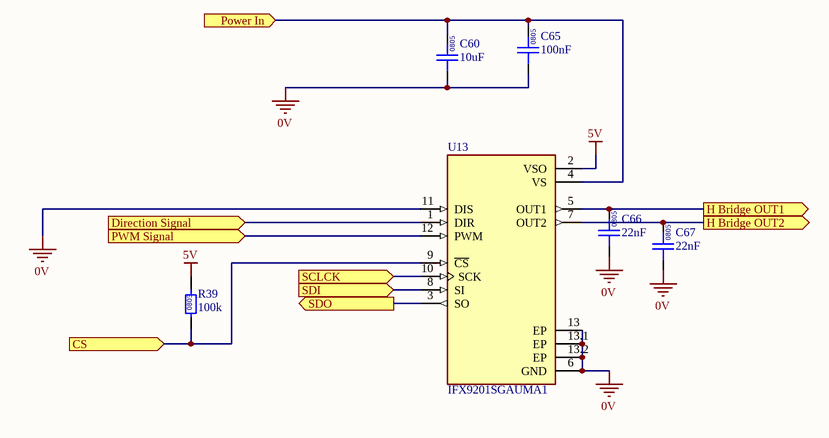
[diagram p7: PWM Outputs.SchDoc]

### Parts
C60  10uF  [0805]
C65  100nF  [0805]
C66  22nF  [0805]
C67  22nF  [0805]
R39  100k  [0805]
U13  IFX9201SGAUMA1  [CONV_IFX9201SGAUMA1]

### Ports
CS (in), Direction Signal (in), H Bridge OUT1 (out), H Bridge OUT2 (out), Power In (in), PWM Signal (in), SCLCK (in), SDI (in), SDO (out)

### Nets
0V: C60.1 C65.1 C66.1 C67.1 U13.6(GND) U13.11(DIS) U13.13(EP) U13.13.1(EP) U13.13.2(EP)
5V: R39.2 U13.2(VSO)
CS: R39.1 U13.9(~{CS}) ; port CS
Direction Signal: U13.1(DIR) ; port Direction Signal
H Bridge OUT1: C66.2 U13.5(OUT1) ; port H Bridge OUT1
H Bridge OUT2: C67.2 U13.7(OUT2) ; port H Bridge OUT2
Power In: C60.2 C65.2 U13.4(VS) ; port Power In
PWM Signal: U13.12(PWM) ; port PWM Signal
SCLCK: U13.10(SCK) ; port SCLCK
SDI: U13.8(SI) ; port SDI
SDO: U13.3(SO) ; port SDO

### Channels
HBA: designators end in _HBA; ports CS=H Bridge A CS Direction Signal=H Bridge A Direction H Bridge OUT1=H Bridge A OUT1 H Bridge OUT2=H Bridge A OUT2 Power In=H Bridge A Power PWM Signal=PWM 1 SCLCK=SCLCK SDI=MOSI SDO=MISO
HBB: designators end in _HBB; ports CS=H Bridge B CS Direction Signal=H Bridge B Direction H Bridge OUT1=H Bridge B OUT1 H Bridge OUT2=H Bridge B OUT2 Power In=H Bridge B Power PWM Signal=PWM 2 SCLCK=SCLCK SDI=MOSI SDO=MISO
HBC: designators end in _HBC; ports CS=H Bridge C CS Direction Signal=H Bridge C Direction H Bridge OUT1=H Bridge C OUT1 H Bridge OUT2=H Bridge C OUT2 Power In=H Bridge C Power PWM Signal=PWM 3 SCLCK=SCLCK SDI=MOSI SDO=MISO
HBD: designators end in _HBD; ports CS=H Bridge D CS Direction Signal=H Bridge D Direction H Bridge OUT1=H Bridge D OUT1 H Bridge OUT2=H Bridge D OUT2 Power In=H Bridge D Power PWM Signal=PWM 4 SCLCK=SCLCK SDI=MOSI SDO=MISO

### Notes on the sheet
- (in symbol GCM21B5C1H223JA16L) 0805
- (in symbol GCM21BR71H104KA37L) 0805
- (in symbol GRM21BR6YA106KE43L) 0805
- (in symbol RC0805FR07100KL) 0805

### Library data of the parts
C60 = GRM21BR6YA106KE43L: as C19 on sheet Power Supply; Part Number: GRM21BR6YA106KE43L; Value: 10uF; Digikey Part Number: 490-10514-6-ND
C65 = GCM21BR71H104KA37L: as C21 on sheet Power Supply; Part Number: GCM21BR71H104KA37L; Value: 100nF; Digikey Part Number: 490-6064-1-ND
C66 C67 = GCM21B5C1H223JA16L: Manufacturer: muRata; Rated Voltage: 50V; Tolerance: ±5%; Material: MLCC; Temperature Rating: C0G, NP0; Part Number: GCM21B5C1H223JA16L; Value: 22nF; Digikey Part Number: 490-5318-1-ND
R39 = RC0805FR07100KL: as R30 on sheet Power Outputs; Part Number: RC0805FR07100KL; Value: 100k; Material: FR-07; Digikey Part Number: 311-100KCRCT-ND
U13 = IFX9201SGAUMA1: IC HALF BRIDGE DRIVER 6A 12DSO; MF: Infineon Technologies; Package: BSOP-12 Infineon; Check_prices: https://www.snapeda.com/parts/IFX9201SGAUMA1/Infineon+Technologies/view-part/?ref=eda; Value: *; Purchase-URL: https://pricing.snapeda.com/search/part/IFX9201SGAUMA1/?ref=eda; Availability: In Stock; SnapEDA_Link: https://www.snapeda.com/parts/IFX9201SGAUMA1/Infineon+Technologies/view-part/?ref=snap; MP: IFX9201SGAUMA1; Price: None; Part Number: IFX9201SGAUMA1; Digikey Part Number: IFX9201SGAUMA1TR-ND; Digikey Link: https://www.digikey.com.au/en/products/detail/infineon-technologies/IFX9201SGAUMA1/5415542; Manufacturer: Infineon Technologies

## Sheet Microcontroller.SchDoc
size A3; SheetNumber: 2; SheetTotal: 9
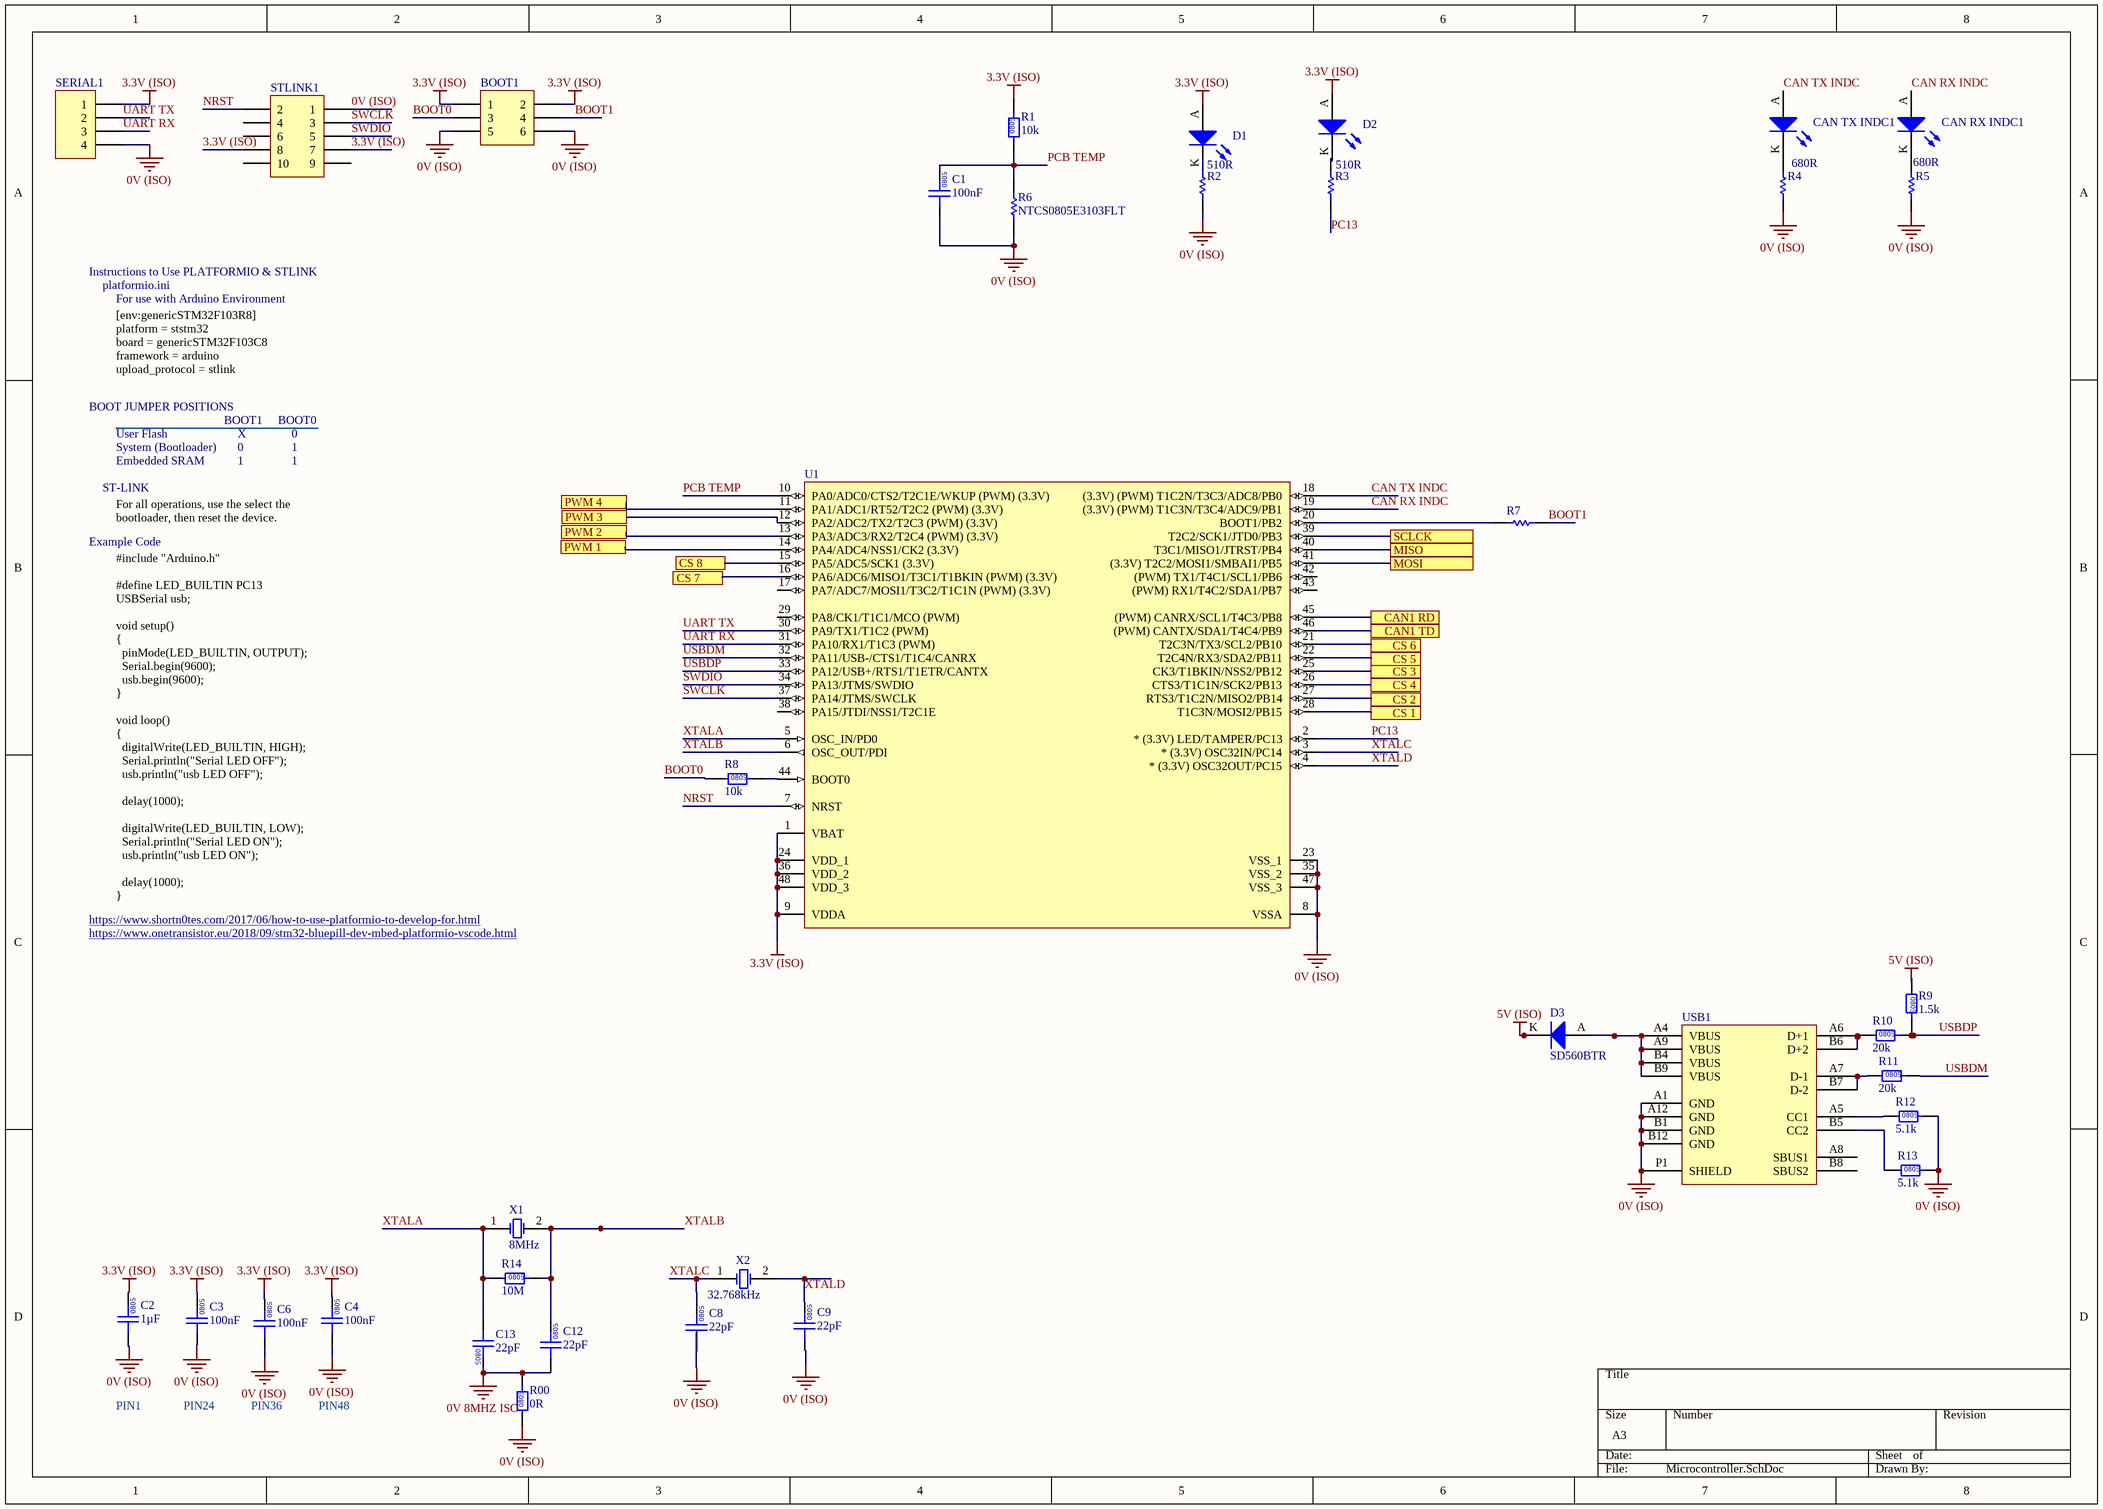
[diagram p8: Microcontroller.SchDoc]

### Parts
BOOT1  (no value)  [TH 2.54mm Header 2x3]
C1  100nF  [0805]
C2  1µF  [0805]
C3  100nF  [0805]
C4  100nF  [0805]
C6  100nF  [0805]
C8  22pF  [0805]
C9  22pF  [0805]
C12  22pF  [0805]
C13  22pF  [0805]
CAN_RX_INDC1  (no value)  [0805 LED]
CAN_TX_INDC1  (no value)  [0805 LED]
D1  (no value)  [0805 LED]
D2  (no value)  [0805 LED]
D3  SD560BTR  [SMB Diode]
R00  0R  [0805]
R1  10k  [0805]
R2  value 510R  [0805]
R3  value 510R  [0805]
R4  value 680R  [0805]
R5  value 680R  [0805]
R6  NTCS0805E3103FLT  [0805]
R7  (no value)  [0805]
R8  10k  [0805]
R9  1.5k  [0805]
R10  20k  [0805]
R11  20k  [0805]
R12  5.1k  [0805]
R13  5.1k  [0805]
R14  10M  [0805]
SERIAL1  (no value)  [TH 2.54mm Header 1x4]
STLINK1  (no value)  [TH 2.54mm Header 2x5]
U1  (no value)  [STM 48-LQFP]
USB1  (no value)  [USB4085-GF-A]
X1  8MHz  [Abracon HC-49/US]
X2  value 32.768kHz  [EPSON 2-SMD]

### Ports
CAN1 RD, CAN1 TD, CS 1, CS 2, CS 3, CS 4, CS 5, CS 6, CS 7, CS 8, MISO, MOSI, PWM 1, PWM 2, PWM 3, PWM 4, SCLCK

### Nets
0V 8MHZ ISO: C12.1 C13.2 R00.2
0V (ISO): BOOT1.5 BOOT1.6 C1.1 C2.1 C3.1 C4.1 C6.1 C8.1 C9.1 R00.1 R2.1 R4.1 R5.1 R6.1 R12.2 R13.2 SERIAL1.4 STLINK1.1 U1.8(VSSA) U1.23(VSS_1) U1.35(VSS_2) U1.47(VSS_3) USB1.A1(GND) USB1.A12(GND) USB1.B1(GND) USB1.B12(GND) USB1.P1(SHIELD)
3.3V (ISO): BOOT1.1 BOOT1.2 C2.2 C3.2 C4.2 C6.2 D1.A D2.A R1.2 SERIAL1.1 STLINK1.7 STLINK1.8 U1.1(VBAT) U1.9(VDDA) U1.24(VDD_1) U1.36(VDD_2) U1.48(VDD_3)
5V (ISO): D3.K R9.1
ADC CS (ISO): U1.28(T1C3N/MOSI2/PB15) ; port CS 1
BOOT0: BOOT1.3 R8.1
BOOT1: BOOT1.4 R7.2
CAN RX INDC: CAN_RX_INDC1.A U1.19((3.3V)_(PWM)_T1C3N/T3C4/ADC9/PB1)
CAN TX INDC: CAN_TX_INDC1.A U1.18((3.3V)_(PWM)_T1C2N/T3C3/ADC8/PB0)
H Bridge A CS (ISO): U1.22(T2C4N/RX3/SDA2/PB11) ; port CS 5
H Bridge B CS (ISO): U1.21(T2C3N/TX3/SCL2/PB10) ; port CS 6
H Bridge C CS (ISO): U1.16(PA6/ADC6/MISO1/T3C1/T1BKIN_(PWM)_(3.3V)) ; port CS 7
H Bridge D CS (ISO): U1.15(PA5/ADC5/SCK1_(3.3V)) ; port CS 8
MISO (ISO): U1.40(T3C1/MISO1/JTRST/PB4) ; port MISO
MOSI (ISO): U1.41((3.3V)_T2C2/MOSI1/SMBAI1/PB5) ; port MOSI
NRST: STLINK1.2 U1.7(NRST)
PC13: R3.1 U1.2(*_(3.3V)_LED/TAMPER/PC13)
PCB TEMP: C1.2 R1.1 R6.2 U1.10(PA0/ADC0/CTS2/T2C1E/WKUP_(PWM)_(3.3V))
SCLCK (ISO): U1.39(T2C2/SCK1/JTD0/PB3) ; port SCLCK
SMRT DRV CTRL CS (ISO): U1.27(RTS3/T1C2N/MISO2/PB14) ; port CS 2
SMRT DRV DIG CS (ISO): U1.25(CK3/T1BKIN/NSS2/PB12) ; port CS 3
SWCLK: STLINK1.3 U1.37(PA14/JTMS/SWCLK)
SWDIO: STLINK1.5 U1.34(PA13/JTMS/SWDIO)
UART RX: SERIAL1.3 U1.31(PA10/RX1/T1C3_(PWM))
UART TX: SERIAL1.2 U1.30(PA9/TX1/T1C2_(PWM))
USBDM: R11.2 U1.32(PA11/USB-/CTS1/T1C4/CANRX)
USBDP: R9.2 R10.2 U1.33(PA12/USB+/RTS1/T1ETR/CANTX)
XTALA: C13.1 R14.1 U1.5(OSC_IN/PD0) X1.1(OSC1)
XTALB: C12.2 R14.2 U1.6(OSC_OUT/PDI) X1.2(OSC2)
XTALC: C8.2 U1.3(*_(3.3V)_OSC32IN/PC14) X2.1(OSC1)
XTALD: C9.2 U1.4(*_(3.3V)_OSC32OUT/PC15) X2.2(OSC2)
NetCAN_RX_INDC1_K: CAN_RX_INDC1.K R5.2
NetCAN_TX_INDC1_K: CAN_TX_INDC1.K R4.2
NetD1_K: D1.K R2.2
NetD2_K: D2.K R3.2
NetD3_A: D3.A USB1.A4(VBUS) USB1.A9(VBUS) USB1.B4(VBUS) USB1.B9(VBUS)
NetR7_1: R7.1 U1.20(BOOT1/PB2)
NetR8_2: R8.2 U1.44(BOOT0)
NetR10_1: R10.1 USB1.A6(D+1) USB1.B6(D+2)
NetR11_1: R11.1 USB1.A7(D-1) USB1.B7(D-2)
NetR12_1: R12.1 USB1.A5(CC1)
NetR13_1: R13.1 USB1.B5(CC2)
NetU1_11: U1.11(PA1/ADC1/RT52/T2C2_(PWM)_(3.3V)) ; port PWM 4
NetU1_12: U1.12(PA2/ADC2/TX2/T2C3_(PWM)_(3.3V)) ; port PWM 3
NetU1_13: U1.13(PA3/ADC3/RX2/T2C4_(PWM)_(3.3V)) ; port PWM 2
NetU1_14: U1.14(PA4/ADC4/NSS1/CK2_(3.3V)) ; port PWM 1
NetU1_26: U1.26(CTS3/T1C1N/SCK2/PB13) ; port CS 4
NetU1_45: U1.45((PWM)_CANRX/SCL1/T4C3/PB8) ; port CAN1 RD
NetU1_46: U1.46((PWM)_CANTX/SDA1/T4C4/PB9) ; port CAN1 TD

Not connected (* = marked no-connect by the designer): STLINK1 4 6 9 10; U1 17(PA7/ADC7/MOSI1/T3C2/T1C1N_(PWM)_(3.3V)) 29(PA8/CK1/T1C1/MCO_(PWM)) 38(PA15/JTDI/NSS1/T2C1E) 42((PWM)_TX1/T4C1/SCL1/PB6) 43((PWM)_RX1/T4C2/SDA1/PB7); USB1 A8(SBUS1) B8(SBUS2)

### Notes on the sheet
- Instructions to Use PLATFORMIO & STLINK
- platformio.ini
- For use with Arduino Environment
- BOOT JUMPER POSITIONS
- [env:genericSTM32F103R8]
  platform = ststm32
  board = genericSTM32F103C8
  framework = arduino
  upload_protocol = stlink
- User Flash
- System (Bootloader)
- BOOT1
- X
- 0
- BOOT0
- 1
- ST-LINK
- Embedded SRAM
- For all operations, use the select the bootloader, then reset the device.
- Example Code
- https://www.shortn0tes.com/2017/06/how-to-use-platformio-to-develop-for.html
- #include "Arduino.h"
  #define LED_BUILTIN PC13
  USBSerial usb;
  void setup()
  {
  pinMode(LED_BUILTIN, OUTPUT);
  Serial.begin(9600);
  usb.begin(9600);
  }
  void loop()
  {
  digitalWrite(LED_BUILTIN, HIGH);
  Serial.println("Serial LED OFF");
  usb.println("usb LED OFF");
  delay(1000);
  digitalWrite(LED_BUILTIN, LOW);
  Serial.println("Serial LED ON");
  usb.println("usb LED ON");
  delay(1000);
  }
- https://www.onetransistor.eu/2018/09/stm32-bluepill-dev-mbed-platformio-vscode.html
- PIN1
- PIN24
- PIN36
- PIN48
- (in symbol GCM21BR71H104KA37L) 0805
- (in symbol GCM21BR71H105KA03L) 0805
- (in symbol GRM21A5C2E220JW01D) 0805
- (in symbol RC0805FR070RL) 0805
- (in symbol RC0805FR071K5L) 0805
- (in symbol RC0805FR075K1L) 0805
- (in symbol RC0805FR0710KL) 0805
- (in symbol RC0805FR0710ML) 0805
- (in symbol RC0805FR0720KL) 0805

### Library data of the parts
BOOT1 = TH 2.54mm Header 2x3: Positions: 6; Pitch: 2.54mm; Angle: 0; Flange: No; Contact: NA; Part Number: TH 2.54mm Header 2x3; Row Spacing: 2.54mm
C1 C3 C4 C6 = GCM21BR71H104KA37L: as C21 on sheet Power Supply; Part Number: GCM21BR71H104KA37L; Value: 100nF; Digikey Part Number: 490-6064-1-ND
C2 = GCM21BR71H105KA03L: as C36 on sheet Power Supply; Part Number: GCM21BR71H105KA03L; Value: 1µF; Digikey Part Number: 490-10675-1-ND
C8 C9 C12 C13 = GRM21A5C2E220JW01D: Manufacturer: muRata; Rated Voltage: 250V; Tolerance: ±5%; Material: MLCC; Temperature Rating: C0G, NP0; Part Number: GRM21A5C2E220JW01D; Value: 22pF; Digikey Part Number: 490-5534-1-ND
CAN_RX_INDC1 CAN_TX_INDC1 = SML-MN2BCTT86C: LED BLUE CLEAR 2012 SMD; Manufacturer: ROHM Semiconductor; Part Number: SML-MN2BCTT86C; Colour: Blue; Digikey Part Number: 846-1207-1-ND; Digikey Link: https://www.digikey.com/product-detail/en/rohm-semiconductor/SMLMN2BCTT86C/846-1207-1-ND/6057239
D1 D2 = SML-210LTT86: as D5 on sheet Power Supply; Part Number: SML-210LTT86; Colour: Red; Digikey Part Number: 511-1286-1-ND; Digikey Link: https://www.digikey.com/product-detail/en/rohm-semiconductor/SML-210LTT86/511-1286-1-ND/637099
D3 = SD560BTR: Manufacturer: SMC Diode Solutions; Forward Voltage: 1.2 V; Breakdown Voltage: 600 V; Part Number: SD560BTR; Digikey Part Number: 1655-1530-2-ND
R00 = RC0805FR070RL: as R24 on sheet Power Supply; Part Number: RC0805FR070RL; Value: 0R; Material: FR-07; Digikey Part Number: 311-0.0CRCT-ND
R1 R8 = RC0805FR0710KL: as R19 on sheet Smart Driver Circuit; Part Number: RC0805FR0710KL; Value: 10k; Material: FR-07; Digikey Part Number: 311-10.0KCRCT-ND
R2 R3 = RC0805FR07510RL: Manufacturer: YAGEO; Tolerance: 0.01; Rated Voltage: 0.125W; Part Number: RC0805FR07510RL; Material: FR-07; Digikey Part Number: 311-510CRCT-ND
R4 R5 = RC0805FR07680RL: Manufacturer: YAGEO; Tolerance: 0.01; Rated Voltage: 0.125W; Part Number: RC0805FR07680RL; Material: FR-07; Digikey Part Number: 311-680CRCT-ND
R6 = CMP-037-000418-3: Tolerance: 0.01; Value: 10K (NTC) (B25/85 3430K); Rated Voltage: 210mW; Digikey Part Number: BC2733CT-ND
R7 = RC0805FR0710KL: Manufacturer: YAGEO; Value: 10k; Tolerance: 0.01; Rated Voltage: 0.125W; Part Number: RC0805FR0710KL; Material: FR-07; Digikey Part Number: 311-10.0KCRCT-ND
R9 = RC0805FR071K5L: Manufacturer: YAGEO; Tolerance: 0.01; Rated Power: 0.125W; Part Number: RC0805FR071K5L; Value: 1.5k; Material: FR-07; Digikey Part Number: 311-1.50KCRCT-ND
R10 R11 = RC0805FR0720KL: Manufacturer: YAGEO; Tolerance: 0.01; Rated Power: 0.125W; Part Number: RC0805FR0720KL; Value: 20k; Material: FR-07; Digikey Part Number: 311-20.0KCRCT-ND
R12 R13 = RC0805FR075K1L: Manufacturer: YAGEO; Tolerance: 0.01; Rated Power: 0.125W; Part Number: RC0805FR075K1L; Value: 5.1k; Material: FR-07; Digikey Part Number: 311-5.10KCRCT-ND
R14 = RC0805FR0710ML: Manufacturer: YAGEO; Tolerance: 0.01; Rated Power: 0.125W; Part Number: RC0805FR0710ML; Value: 10M; Material: FR-07; Digikey Part Number: 311-10.0MCRCT-ND
SERIAL1 = TH 2.54mm Header 1x4: Positions: 4; Pitch: 2.54mm; Angle: 0; Flange: No; Contact: NA; Part Number: TH 2.54mm Header 1x4; Row Spacing: 2.54mm
STLINK1 = TH 2.54mm Header 2x5: Positions: 10; Pitch: 2.54mm; Angle: 0; Flange: No; Contact: NA; Part Number: TH 2.54mm Header 2x5; Row Spacing: 2.54mm
U1 = STM32F103C8T6: ARM® Cortex®-M3 STM32F1 Microcontroller IC 32-Bit 72MHz 64KB (64K x 8) FLASH; Manufacturer: STMicroelectronics; Part Number: STM32F103C8T6; Digikey Part Number: 497-6063-ND; Digikey Link: https://www.digikey.com/product-detail/en/stmicroelectronics/STM32F103C8T6/497-6063-ND/1646338
USB1 = USB4085-GF-A: USB - C (Type - C) USB 2.0 Receptacle Connector 16 Position Through Hole, Right Angle; Angle: 90; Part Number: USB4085-GF-A; Digikey Part Number: 2073-USB4085-GF-ACT-ND; Digikey Link: https://www.digikey.ee/product-detail/en/gct/USB4085-GF-A/2073-USB4085-GF-ACT-ND/9859733
X1 = ABLS-8.000MHZ-B4-T: Manufacturer: Abracon LLC; Load Capacitance: 18pF; ESR: 80R; Part Number: ABLS-8.000MHZ-B4-T; Value: 8MHz; Digikey Part Number: 535-10212-2-ND; Digikey Link: https://www.digikey.com/product-detail/en/abracon-llc/ABLS-8.000MHZ-B4-T/535-10212-2-ND/2184155
X2 = FC-135 32.7680KA-A5: Manufacturer: EPSON; Load Capacitance: 12.5pF; ESR: 70k; Part Number: FC-135 32.7680KA-A5; Digikey Part Number: SER4103TR-ND; Digikey Link: https://www.digikey.com/product-detail/en/epson/FC-135-32.7680KA-A5/SER4103TR-ND/5259895